# EAGLE design Main_board (EAGLE 9.6.2)

## Sheet 1 of 3
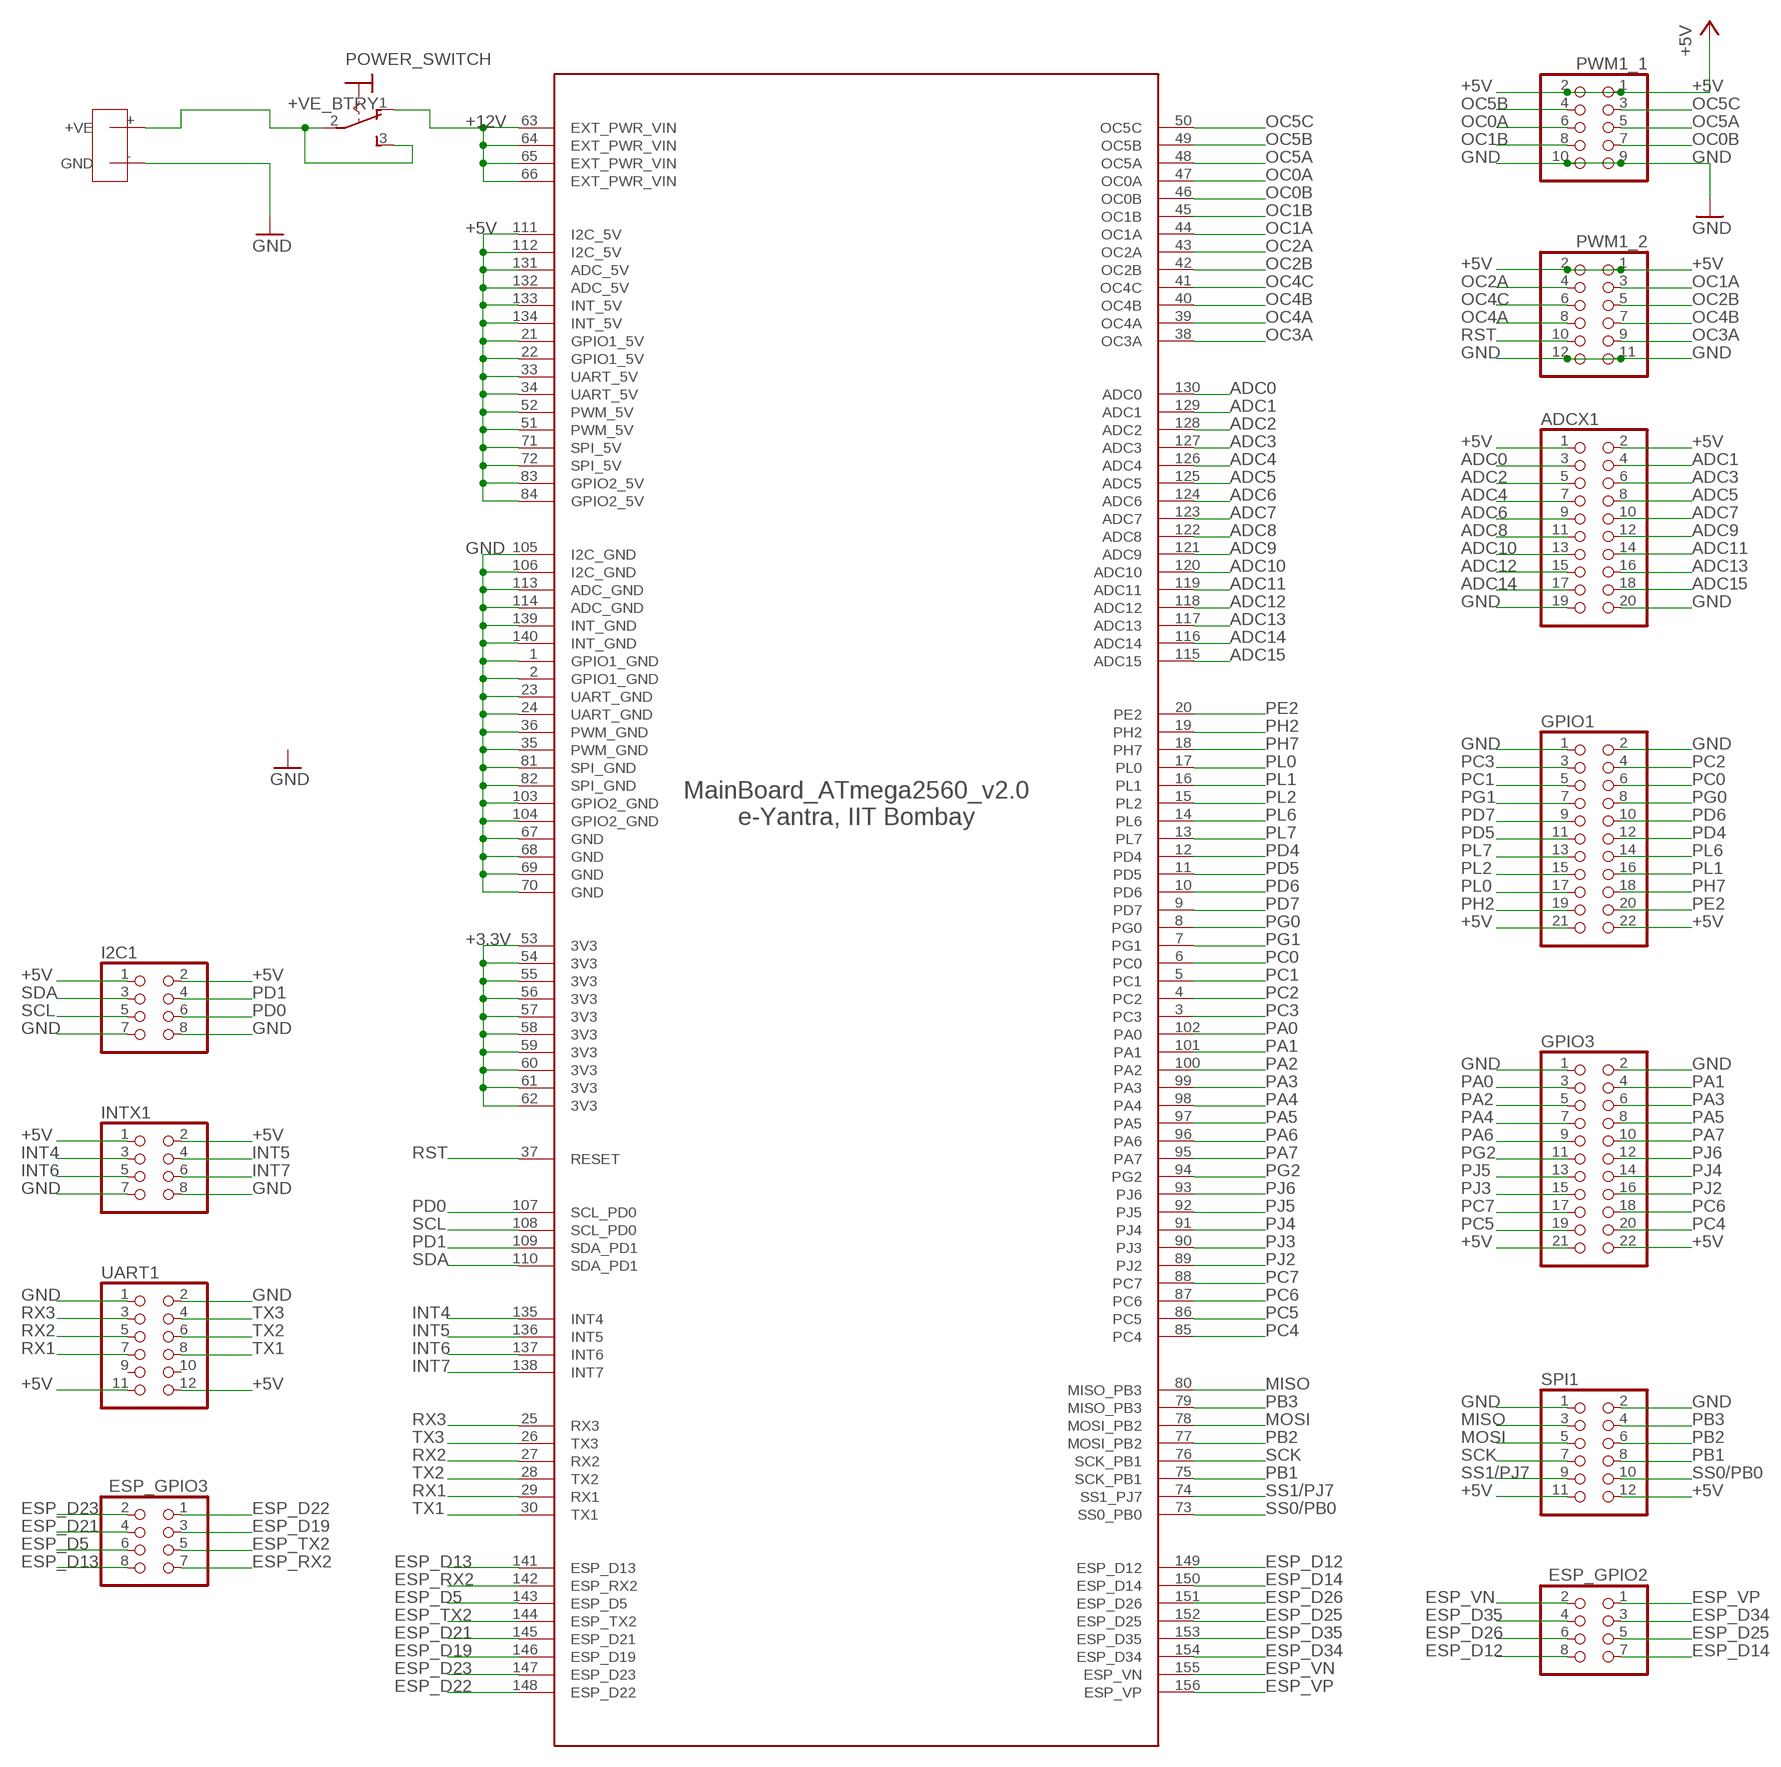
[diagram p0: schematic, sheet 1]

### Parts
ADCX1  PINHD-2X10  [2X10]
ESP_GPIO2  PINHD-2X4  [2X04]
ESP_GPIO3  PINHD-2X4  [2X04]
EYFI_MEGA  ATMEGA2560_V2.0  [ATMEGA2560_V2.0]
GPIO1  PINHD-2X11  [2X11]
GPIO3  PINHD-2X11  [2X11]
I2C1  PINHD-2X4  [2X04]
INTX1  PINHD-2X4  [2X04]
POWER_SWITCH  M9040P  [M9040P]
PWM1_1  PINHD-2X5  [2X05]
PWM1_2  PINHD-2X6  [2X06]
SPI1  PINHD-2X6  [2X06]
U$1  DEANS  [DEANS]
UART1  PINHD-2X6  [2X06]

### Nets
+3.3V: EYFI_MEGA.53(3V3) EYFI_MEGA.54(3V3) EYFI_MEGA.55(3V3) EYFI_MEGA.56(3V3) EYFI_MEGA.57(3V3) EYFI_MEGA.58(3V3) EYFI_MEGA.59(3V3) EYFI_MEGA.60(3V3) EYFI_MEGA.61(3V3) EYFI_MEGA.62(3V3) ; also sheet 2
+5V [+5V_SUPPLY]: ADCX1.1 ADCX1.2 EYFI_MEGA.21(GPIO1_5V) EYFI_MEGA.22(GPIO1_5V) EYFI_MEGA.33(UART_5V) EYFI_MEGA.34(UART_5V) EYFI_MEGA.51(PWM_5V) EYFI_MEGA.52(PWM_5V) EYFI_MEGA.71(SPI_5V) EYFI_MEGA.72(SPI_5V) EYFI_MEGA.83(GPIO2_5V) EYFI_MEGA.84(GPIO2_5V) EYFI_MEGA.111(I2C_5V) EYFI_MEGA.112(I2C_5V) EYFI_MEGA.131(ADC_5V) EYFI_MEGA.132(ADC_5V) EYFI_MEGA.133(INT_5V) EYFI_MEGA.134(INT_5V) GPIO1.21 GPIO1.22 GPIO3.21 GPIO3.22 I2C1.1 I2C1.2 INTX1.1 INTX1.2 PWM1_1.1 PWM1_1.2 PWM1_2.1 PWM1_2.2 SPI1.11 SPI1.12 UART1.11 UART1.12 ; also sheet 2
+12V [+12V_SUPPLY]: EYFI_MEGA.63(EXT_PWR_VIN) EYFI_MEGA.64(EXT_PWR_VIN) EYFI_MEGA.65(EXT_PWR_VIN) EYFI_MEGA.66(EXT_PWR_VIN) POWER_SWITCH.1(O) ; also sheet 2
+VE_BTRY [+12V_SUPPLY]: POWER_SWITCH.2(P) POWER_SWITCH.3(S) U$1.+(+VE)
ADC0: ADCX1.3 EYFI_MEGA.130(ADC0) ; also sheet 2
ADC1: ADCX1.4 EYFI_MEGA.129(ADC1) ; also sheet 2
ADC2: ADCX1.5 EYFI_MEGA.128(ADC2) ; also sheet 2
ADC3: ADCX1.6 EYFI_MEGA.127(ADC3) ; also sheet 2
ADC4: ADCX1.7 EYFI_MEGA.126(ADC4)
ADC5: ADCX1.8 EYFI_MEGA.125(ADC5)
ADC6: ADCX1.9 EYFI_MEGA.124(ADC6)
ADC7: ADCX1.10 EYFI_MEGA.123(ADC7)
ADC8: ADCX1.11 EYFI_MEGA.122(ADC8)
ADC9: ADCX1.12 EYFI_MEGA.121(ADC9)
ADC10: ADCX1.13 EYFI_MEGA.120(ADC10)
ADC11: ADCX1.14 EYFI_MEGA.119(ADC11)
ADC12: ADCX1.15 EYFI_MEGA.118(ADC12) ; also sheet 2
ADC13: ADCX1.16 EYFI_MEGA.117(ADC13) ; also sheet 2
ADC14: ADCX1.17 EYFI_MEGA.116(ADC14) ; also sheet 2
ADC15: ADCX1.18 EYFI_MEGA.115(ADC15) ; also sheet 2
ESP_D5: ESP_GPIO3.6 EYFI_MEGA.143(ESP_D5)
ESP_D12: ESP_GPIO2.8 EYFI_MEGA.149(ESP_D12)
ESP_D13: ESP_GPIO3.8 EYFI_MEGA.141(ESP_D13)
ESP_D14: ESP_GPIO2.7 EYFI_MEGA.150(ESP_D14)
ESP_D19: ESP_GPIO3.3 EYFI_MEGA.146(ESP_D19)
ESP_D21: ESP_GPIO3.4 EYFI_MEGA.145(ESP_D21)
ESP_D22: ESP_GPIO3.1 EYFI_MEGA.148(ESP_D22)
ESP_D23: ESP_GPIO3.2 EYFI_MEGA.147(ESP_D23)
ESP_D25: ESP_GPIO2.5 EYFI_MEGA.152(ESP_D25)
ESP_D26: ESP_GPIO2.6 EYFI_MEGA.151(ESP_D26)
ESP_D34: ESP_GPIO2.3 EYFI_MEGA.154(ESP_D34)
ESP_D35: ESP_GPIO2.4 EYFI_MEGA.153(ESP_D35)
ESP_RX2: ESP_GPIO3.7 EYFI_MEGA.142(ESP_RX2)
ESP_TX2: ESP_GPIO3.5 EYFI_MEGA.144(ESP_TX2)
ESP_VN [+5V_SUPPLY]: ESP_GPIO2.2 EYFI_MEGA.155(ESP_VN)
ESP_VP [+5V_SUPPLY]: ESP_GPIO2.1 EYFI_MEGA.156(ESP_VP)
GND: ADCX1.19 ADCX1.20 EYFI_MEGA.1(GPIO1_GND) EYFI_MEGA.2(GPIO1_GND) EYFI_MEGA.23(UART_GND) EYFI_MEGA.24(UART_GND) EYFI_MEGA.35(PWM_GND) EYFI_MEGA.36(PWM_GND) EYFI_MEGA.67(GND) EYFI_MEGA.68(GND) EYFI_MEGA.69(GND) EYFI_MEGA.70(GND) EYFI_MEGA.81(SPI_GND) EYFI_MEGA.82(SPI_GND) EYFI_MEGA.103(GPIO2_GND) EYFI_MEGA.104(GPIO2_GND) EYFI_MEGA.105(I2C_GND) EYFI_MEGA.106(I2C_GND) EYFI_MEGA.113(ADC_GND) EYFI_MEGA.114(ADC_GND) EYFI_MEGA.139(INT_GND) EYFI_MEGA.140(INT_GND) GPIO1.1 GPIO1.2 GPIO3.1 GPIO3.2 I2C1.7 I2C1.8 INTX1.7 INTX1.8 PWM1_1.9 PWM1_1.10 PWM1_2.11 PWM1_2.12 SPI1.1 SPI1.2 U$1.-(GND) UART1.1 UART1.2 ; also sheet 2
INT4: EYFI_MEGA.135(INT4) INTX1.3 ; also sheet 2
INT5: EYFI_MEGA.136(INT5) INTX1.4 ; also sheet 2
INT6: EYFI_MEGA.137(INT6) INTX1.5 ; also sheet 2
INT7: EYFI_MEGA.138(INT7) INTX1.6 ; also sheet 2
MISO: EYFI_MEGA.80(MISO_PB3) SPI1.3
MOSI: EYFI_MEGA.78(MOSI_PB2) SPI1.5
OC0A: EYFI_MEGA.47(OC0A) PWM1_1.6
OC0B: EYFI_MEGA.46(OC0B) PWM1_1.7
OC1A: EYFI_MEGA.44(OC1A) PWM1_2.3
OC1B: EYFI_MEGA.45(OC1B) PWM1_1.8 ; also sheet 2
OC2A: EYFI_MEGA.43(OC2A) PWM1_2.4
OC2B: EYFI_MEGA.42(OC2B) PWM1_2.5 ; also sheet 2
OC3A: EYFI_MEGA.38(OC3A) PWM1_2.9 ; also sheet 2
OC4A: EYFI_MEGA.39(OC4A) PWM1_2.8 ; also sheet 2
OC4B: EYFI_MEGA.40(OC4B) PWM1_2.7 ; also sheet 2
OC4C: EYFI_MEGA.41(OC4C) PWM1_2.6 ; also sheet 2
OC5A: EYFI_MEGA.48(OC5A) PWM1_1.5 ; also sheet 2
OC5B: EYFI_MEGA.49(OC5B) PWM1_1.4 ; also sheet 2
OC5C: EYFI_MEGA.50(OC5C) PWM1_1.3
PA0: EYFI_MEGA.102(PA0) GPIO3.3 ; also sheet 2
PA1: EYFI_MEGA.101(PA1) GPIO3.4 ; also sheet 2
PA2: EYFI_MEGA.100(PA2) GPIO3.5 ; also sheet 2
PA3: EYFI_MEGA.99(PA3) GPIO3.6 ; also sheet 2
PA4: EYFI_MEGA.98(PA4) GPIO3.7 ; also sheet 2
PA5: EYFI_MEGA.97(PA5) GPIO3.8 ; also sheet 2
PA6: EYFI_MEGA.96(PA6) GPIO3.9 ; also sheet 2
PA7: EYFI_MEGA.95(PA7) GPIO3.10 ; also sheet 2
PB1: EYFI_MEGA.75(SCK_PB1) SPI1.8
PB2: EYFI_MEGA.77(MOSI_PB2) SPI1.6
PB3: EYFI_MEGA.79(MISO_PB3) SPI1.4
PC0: EYFI_MEGA.6(PC0) GPIO1.6 ; also sheet 2
PC1: EYFI_MEGA.5(PC1) GPIO1.5 ; also sheet 2
PC2: EYFI_MEGA.4(PC2) GPIO1.4 ; also sheet 2
PC3: EYFI_MEGA.3(PC3) GPIO1.3 ; also sheet 2
PC4: EYFI_MEGA.85(PC4) GPIO3.20 ; also sheet 2
PC5: EYFI_MEGA.86(PC5) GPIO3.19 ; also sheet 2
PC6: EYFI_MEGA.87(PC6) GPIO3.18 ; also sheet 2
PC7: EYFI_MEGA.88(PC7) GPIO3.17 ; also sheet 2
PD0: EYFI_MEGA.107(SCL_PD0) I2C1.6
PD1: EYFI_MEGA.109(SDA_PD1) I2C1.4
PD4: EYFI_MEGA.12(PD4) GPIO1.12 ; also sheet 2
PD5: EYFI_MEGA.11(PD5) GPIO1.11 ; also sheet 2
PD6: EYFI_MEGA.10(PD6) GPIO1.10 ; also sheet 2
PD7: EYFI_MEGA.9(PD7) GPIO1.9 ; also sheet 2
PE2: EYFI_MEGA.20(PE2) GPIO1.20
PG0: EYFI_MEGA.8(PG0) GPIO1.8
PG1: EYFI_MEGA.7(PG1) GPIO1.7
PG2: EYFI_MEGA.94(PG2) GPIO3.11 ; also sheet 2
PH2: EYFI_MEGA.19(PH2) GPIO1.19
PH7: EYFI_MEGA.18(PH7) GPIO1.18
PJ2: EYFI_MEGA.89(PJ2) GPIO3.16
PJ3: EYFI_MEGA.90(PJ3) GPIO3.15
PJ4: EYFI_MEGA.91(PJ4) GPIO3.14
PJ5: EYFI_MEGA.92(PJ5) GPIO3.13
PJ6: EYFI_MEGA.93(PJ6) GPIO3.12 ; also sheet 2
PL0: EYFI_MEGA.17(PL0) GPIO1.17
PL1: EYFI_MEGA.16(PL1) GPIO1.16
PL2: EYFI_MEGA.15(PL2) GPIO1.15
PL6: EYFI_MEGA.14(PL6) GPIO1.14
PL7: EYFI_MEGA.13(PL7) GPIO1.13
RST: EYFI_MEGA.37(RESET) PWM1_2.10
RX1: EYFI_MEGA.29(RX1) UART1.7 ; also sheet 2
RX2: EYFI_MEGA.27(RX2) UART1.5
RX3: EYFI_MEGA.25(RX3) UART1.3
SCK: EYFI_MEGA.76(SCK_PB1) SPI1.7
SCL: EYFI_MEGA.108(SCL_PD0) I2C1.5 ; also sheet 2
SDA: EYFI_MEGA.110(SDA_PD1) I2C1.3 ; also sheet 2
SS0/PB0: EYFI_MEGA.73(SS0_PB0) SPI1.10
SS1/PJ7: EYFI_MEGA.74(SS1_PJ7) SPI1.9
TX1: EYFI_MEGA.30(TX1) UART1.8
TX2: EYFI_MEGA.28(TX2) UART1.6
TX3: EYFI_MEGA.26(TX3) UART1.4
Unconnected: UART1.9 UART1.10

## Sheet 2 of 3
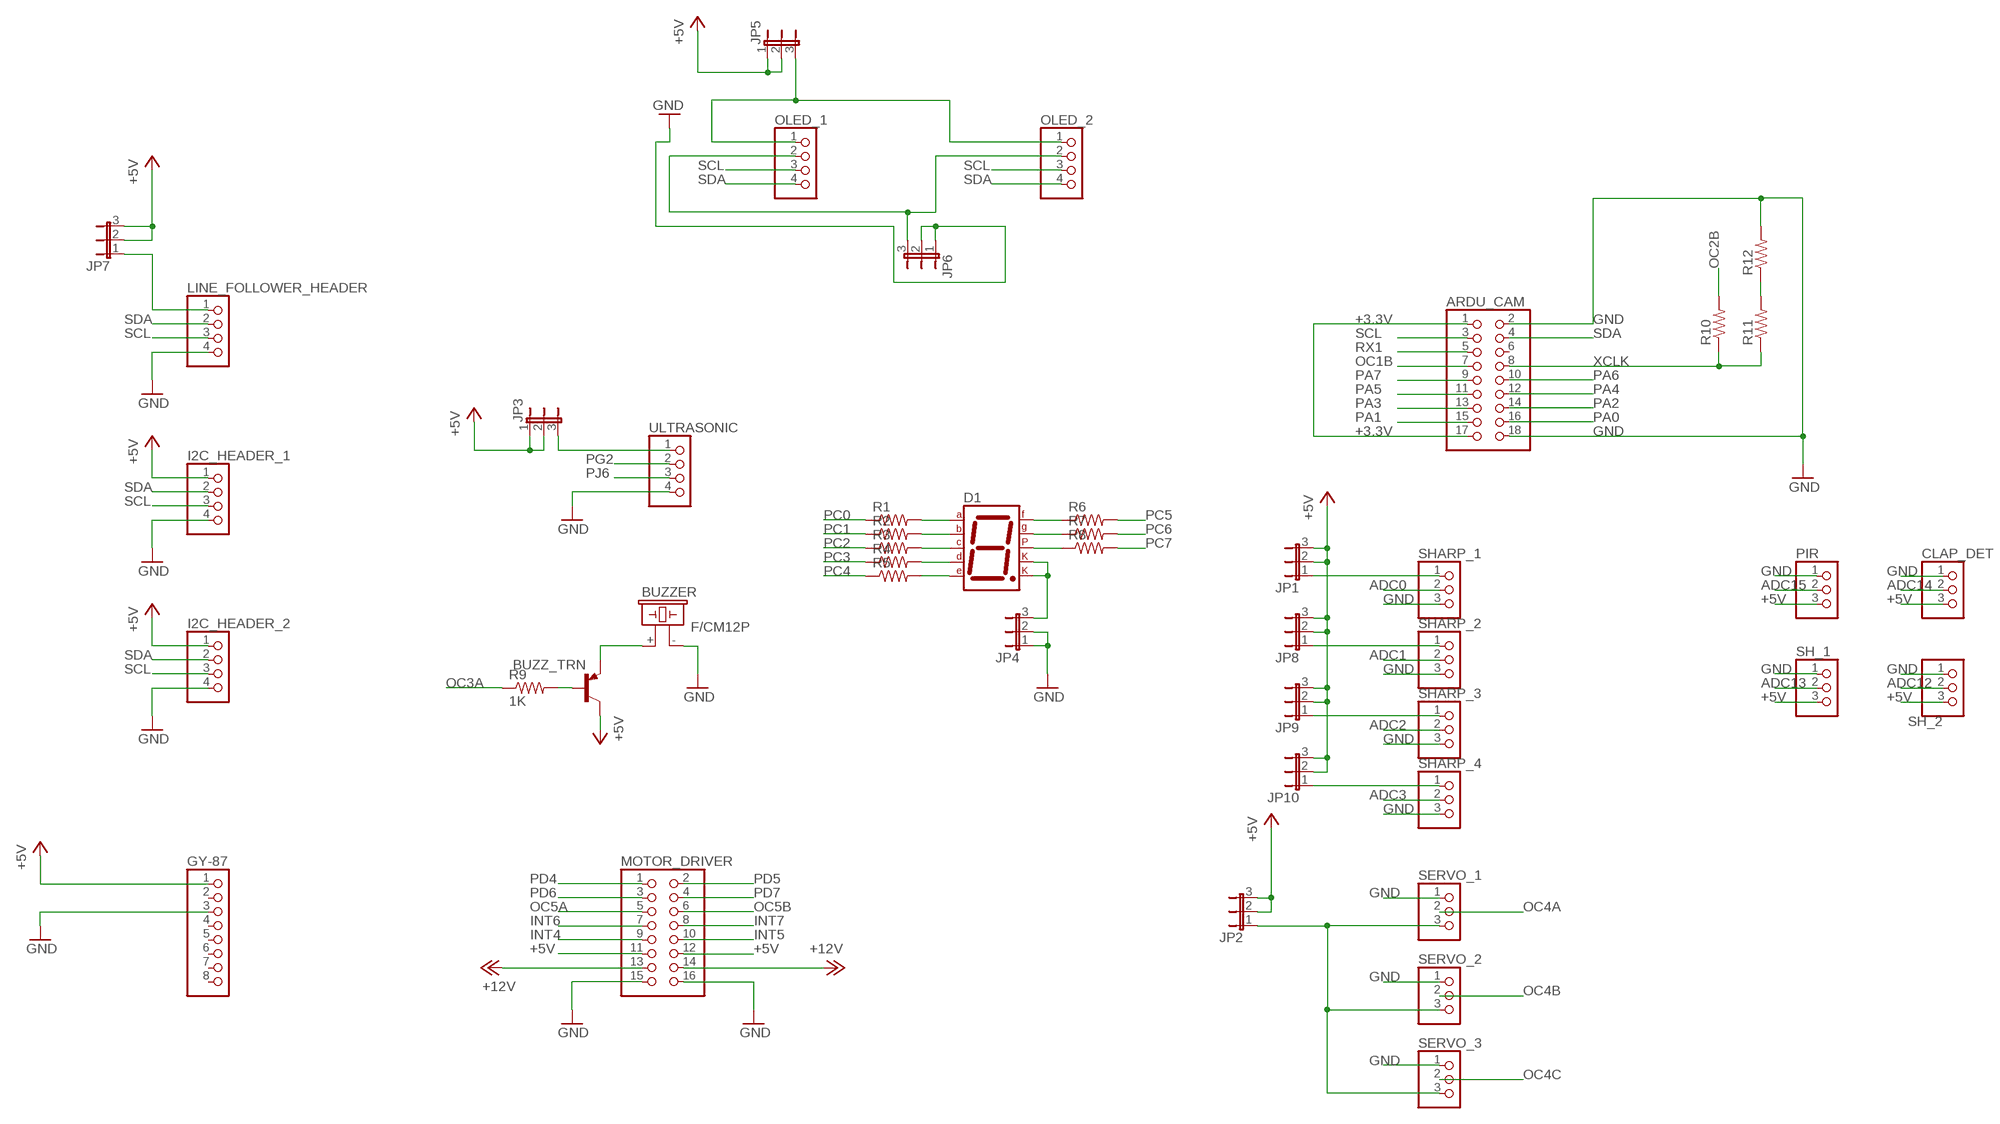
[diagram p1: schematic, sheet 2]

### Parts
ARDU_CAM  PINHD-2X9  [2X09]
BUZZ_TRN  BC807-16-PNP-SOT23-BEC  [SOT23-BEC]
BUZZER  F/CM12P  [F/CM12P]
CLAP_DET  PINHD-1X3  [1X03]
D1  7SEG-CK  [7SEG-13]
GY-87  PINHD-1X8  [1X08]
I2C_HEADER_1  PINHD-1X4  [1X04]
I2C_HEADER_2  PINHD-1X4  [1X04]
JP1  JP2E  [JP2]
JP2  JP2E  [JP2]
JP3  JP2E  [JP2]
JP4  JP2E  [JP2]
JP5  JP2E  [JP2]
JP6  JP2E  [JP2]
JP7  JP2E  [JP2]
JP8  JP2E  [JP2]
JP9  JP2E  [JP2]
JP10  JP2E  [JP2]
LINE_FOLLOWER_HEADER  PINHD-1X4  [1X04]
MOTOR_DRIVER  PINHD-2X8  [2X08]
OLED_1  PINHD-1X4  [1X04]
OLED_2  PINHD-1X4  [1X04]
PIR  PINHD-1X3  [1X03]
R1  R-US_R1206  [R1206]
R2  R-US_R1206  [R1206]
R3  R-US_R1206  [R1206]
R4  R-US_R1206  [R1206]
R5  R-US_R1206  [R1206]
R6  R-US_R1206  [R1206]
R7  R-US_R1206  [R1206]
R8  R-US_R1206  [R1206]
R9  1K  R-US_R1206  [R1206]
R10  R-US_R1206  [R1206]
R11  R-US_R1206  [R1206]
R12  R-US_R1206  [R1206]
SERVO_1  PINHD-1X3  [1X03]
SERVO_2  PINHD-1X3  [1X03]
SERVO_3  PINHD-1X3  [1X03]
SH_1  PINHD-1X3  [1X03]
SH_2  PINHD-1X3  [1X03]
SHARP_1  PINHD-1X3  [1X03]
SHARP_2  PINHD-1X3  [1X03]
SHARP_3  PINHD-1X3  [1X03]
SHARP_4  PINHD-1X3  [1X03]
ULTRASONIC  PINHD-1X4  [1X04]

### Nets
+3.3V: ARDU_CAM.1 ARDU_CAM.17 ; also sheet 1
+5V [+5V_SUPPLY]: BUZZ_TRN.C CLAP_DET.3 GY-87.1 I2C_HEADER_1.1 I2C_HEADER_2.1 JP1.2 JP1.3 JP2.2 JP2.3 JP3.1 JP3.2 JP5.1 JP5.2 JP7.2 JP7.3 JP8.2 JP8.3 JP9.2 JP9.3 JP10.2 JP10.3 MOTOR_DRIVER.11 MOTOR_DRIVER.12 PIR.3 SH_1.3 SH_2.3 ; also sheet 1
+12V [+12V_SUPPLY]: MOTOR_DRIVER.13 MOTOR_DRIVER.14 ; also sheet 1
ADC0: SHARP_1.2 ; also sheet 1
ADC1: SHARP_2.2 ; also sheet 1
ADC2: SHARP_3.2 ; also sheet 1
ADC3: SHARP_4.2 ; also sheet 1
ADC12: SH_2.2 ; also sheet 1
ADC13: SH_1.2 ; also sheet 1
ADC14: CLAP_DET.2 ; also sheet 1
ADC15: PIR.2 ; also sheet 1
GND: ARDU_CAM.2 ARDU_CAM.18 BUZZER.- CLAP_DET.1 GY-87.3 I2C_HEADER_1.4 I2C_HEADER_2.4 JP4.1 JP4.2 JP6.1 JP6.2 LINE_FOLLOWER_HEADER.4 MOTOR_DRIVER.15 MOTOR_DRIVER.16 PIR.1 R12.2 SERVO_1.1 SERVO_2.1 SERVO_3.1 SH_1.1 SH_2.1 SHARP_1.3 SHARP_2.3 SHARP_3.3 SHARP_4.3 ULTRASONIC.4 ; also sheet 1
INT4: MOTOR_DRIVER.9 ; also sheet 1
INT5: MOTOR_DRIVER.10 ; also sheet 1
INT6: MOTOR_DRIVER.7 ; also sheet 1
INT7: MOTOR_DRIVER.8 ; also sheet 1
N$1 [+5V_SUPPLY]: JP1.1 SHARP_1.1
N$2: D1.7(A) R1.2
N$3: BUZZ_TRN.E BUZZER.+
N$4: D1.6(B) R2.2
N$5: BUZZ_TRN.B R9.2
N$6: D1.4(C) R3.2
N$7: D1.2(D) R4.2
N$8: D1.1(E) R5.2
N$9: D1.9(F) R6.1
N$10: D1.10(G) R7.1
N$11: D1.5(DP) R8.1
N$12 [+5V_SUPPLY]: JP3.3 ULTRASONIC.1
N$13: D1.3(CK1) D1.8(CK2) JP4.3
N$14 [+5V_SUPPLY]: JP5.3 OLED_1.1 OLED_2.1
N$15: JP6.3 OLED_1.2 OLED_2.2
N$16: JP7.1 LINE_FOLLOWER_HEADER.1
N$17: R11.2 R12.1
N$18 [+5V_SUPPLY]: JP8.1 SHARP_2.1
N$19 [+5V_SUPPLY]: JP10.1 SHARP_4.1
N$22 [+5V_SUPPLY]: JP9.1 SHARP_3.1
N$23 [+5V_SUPPLY]: JP2.1 SERVO_1.3 SERVO_2.3 SERVO_3.3
OC1B: ARDU_CAM.7 ; also sheet 1
OC2B: R10.2 ; also sheet 1
OC3A: R9.1 ; also sheet 1
OC4A: SERVO_1.2 ; also sheet 1
OC4B: SERVO_2.2 ; also sheet 1
OC4C: SERVO_3.2 ; also sheet 1
OC5A: MOTOR_DRIVER.5 ; also sheet 1
OC5B: MOTOR_DRIVER.6 ; also sheet 1
PA0: ARDU_CAM.16 ; also sheet 1
PA1: ARDU_CAM.15 ; also sheet 1
PA2: ARDU_CAM.14 ; also sheet 1
PA3: ARDU_CAM.13 ; also sheet 1
PA4: ARDU_CAM.12 ; also sheet 1
PA5: ARDU_CAM.11 ; also sheet 1
PA6: ARDU_CAM.10 ; also sheet 1
PA7: ARDU_CAM.9 ; also sheet 1
PC0: R1.1 ; also sheet 1
PC1: R2.1 ; also sheet 1
PC2: R3.1 ; also sheet 1
PC3: R4.1 ; also sheet 1
PC4: R5.1 ; also sheet 1
PC5: R6.2 ; also sheet 1
PC6: R7.2 ; also sheet 1
PC7: R8.2 ; also sheet 1
PD4: MOTOR_DRIVER.1 ; also sheet 1
PD5: MOTOR_DRIVER.2 ; also sheet 1
PD6: MOTOR_DRIVER.3 ; also sheet 1
PD7: MOTOR_DRIVER.4 ; also sheet 1
PG2: ULTRASONIC.2 ; also sheet 1
PJ6: ULTRASONIC.3 ; also sheet 1
RX1: ARDU_CAM.5 ; also sheet 1
SCL: ARDU_CAM.3 I2C_HEADER_1.3 I2C_HEADER_2.3 LINE_FOLLOWER_HEADER.3 OLED_1.3 OLED_2.3 ; also sheet 1
SDA: ARDU_CAM.4 I2C_HEADER_1.2 I2C_HEADER_2.2 LINE_FOLLOWER_HEADER.2 OLED_1.4 OLED_2.4 ; also sheet 1
XCLK: ARDU_CAM.8 R10.1 R11.1
Unconnected: ARDU_CAM.6 GY-87.2 GY-87.4 GY-87.5 GY-87.6 GY-87.7 GY-87.8

## Sheet 3 of 3

## Library data of the parts
ADCX1 = pinhead:PINHD-2X10: PIN HEADER
ARDU_CAM = pinhead:PINHD-2X9: PIN HEADER
BUZZ_TRN = transistor:*-PNP-: PNP Transistror
BUZZER = buzzer:F/CM12P: BUZZER Source: Buerklin; OC_FARNELL: unknown; OC_NEWARK: unknown
CLAP_DET PIR SERVO_1-SERVO_3 SH_1 SH_2 SHARP_1-SHARP_4 = pinhead:PINHD-1X3: PIN HEADER
D1 = special:7SEG-CK: 7-segment DISPLAY single cathode, 13 mm
ESP_GPIO2 ESP_GPIO3 I2C1 INTX1 = pinhead:PINHD-2X4: PIN HEADER
EYFI_MEGA = eYFi-Mega_v2.0.1:ATMEGA2560_V2.0
GPIO1 GPIO3 = pinhead:PINHD-2X11: PIN HEADER
GY-87 = pinhead:PINHD-1X8: PIN HEADER
I2C_HEADER_1 I2C_HEADER_2 LINE_FOLLOWER_HEADER OLED_1 OLED_2 ULTRASONIC = pinhead:PINHD-1X4: PIN HEADER
JP1-JP10 = jumper:JP2E: JUMPER
MOTOR_DRIVER = pinhead:PINHD-2X8: PIN HEADER
POWER_SWITCH = switch:M9040P: TOGGLE SWITCH Marquardt
PWM1_1 = pinhead:PINHD-2X5: PIN HEADER
PWM1_2 SPI1 UART1 = pinhead:PINHD-2X6: PIN HEADER
R1-R12 = rcl:R-US_: RESISTOR, American symbol; SPICEPREFIX: R
U$1 = DEANS:DEANS

## Net classes
0 default: width 0.305 mm
1 +5V_SUPPLY: width 0.813 mm
2 +12V_SUPPLY: width 1.27 mm

## Board
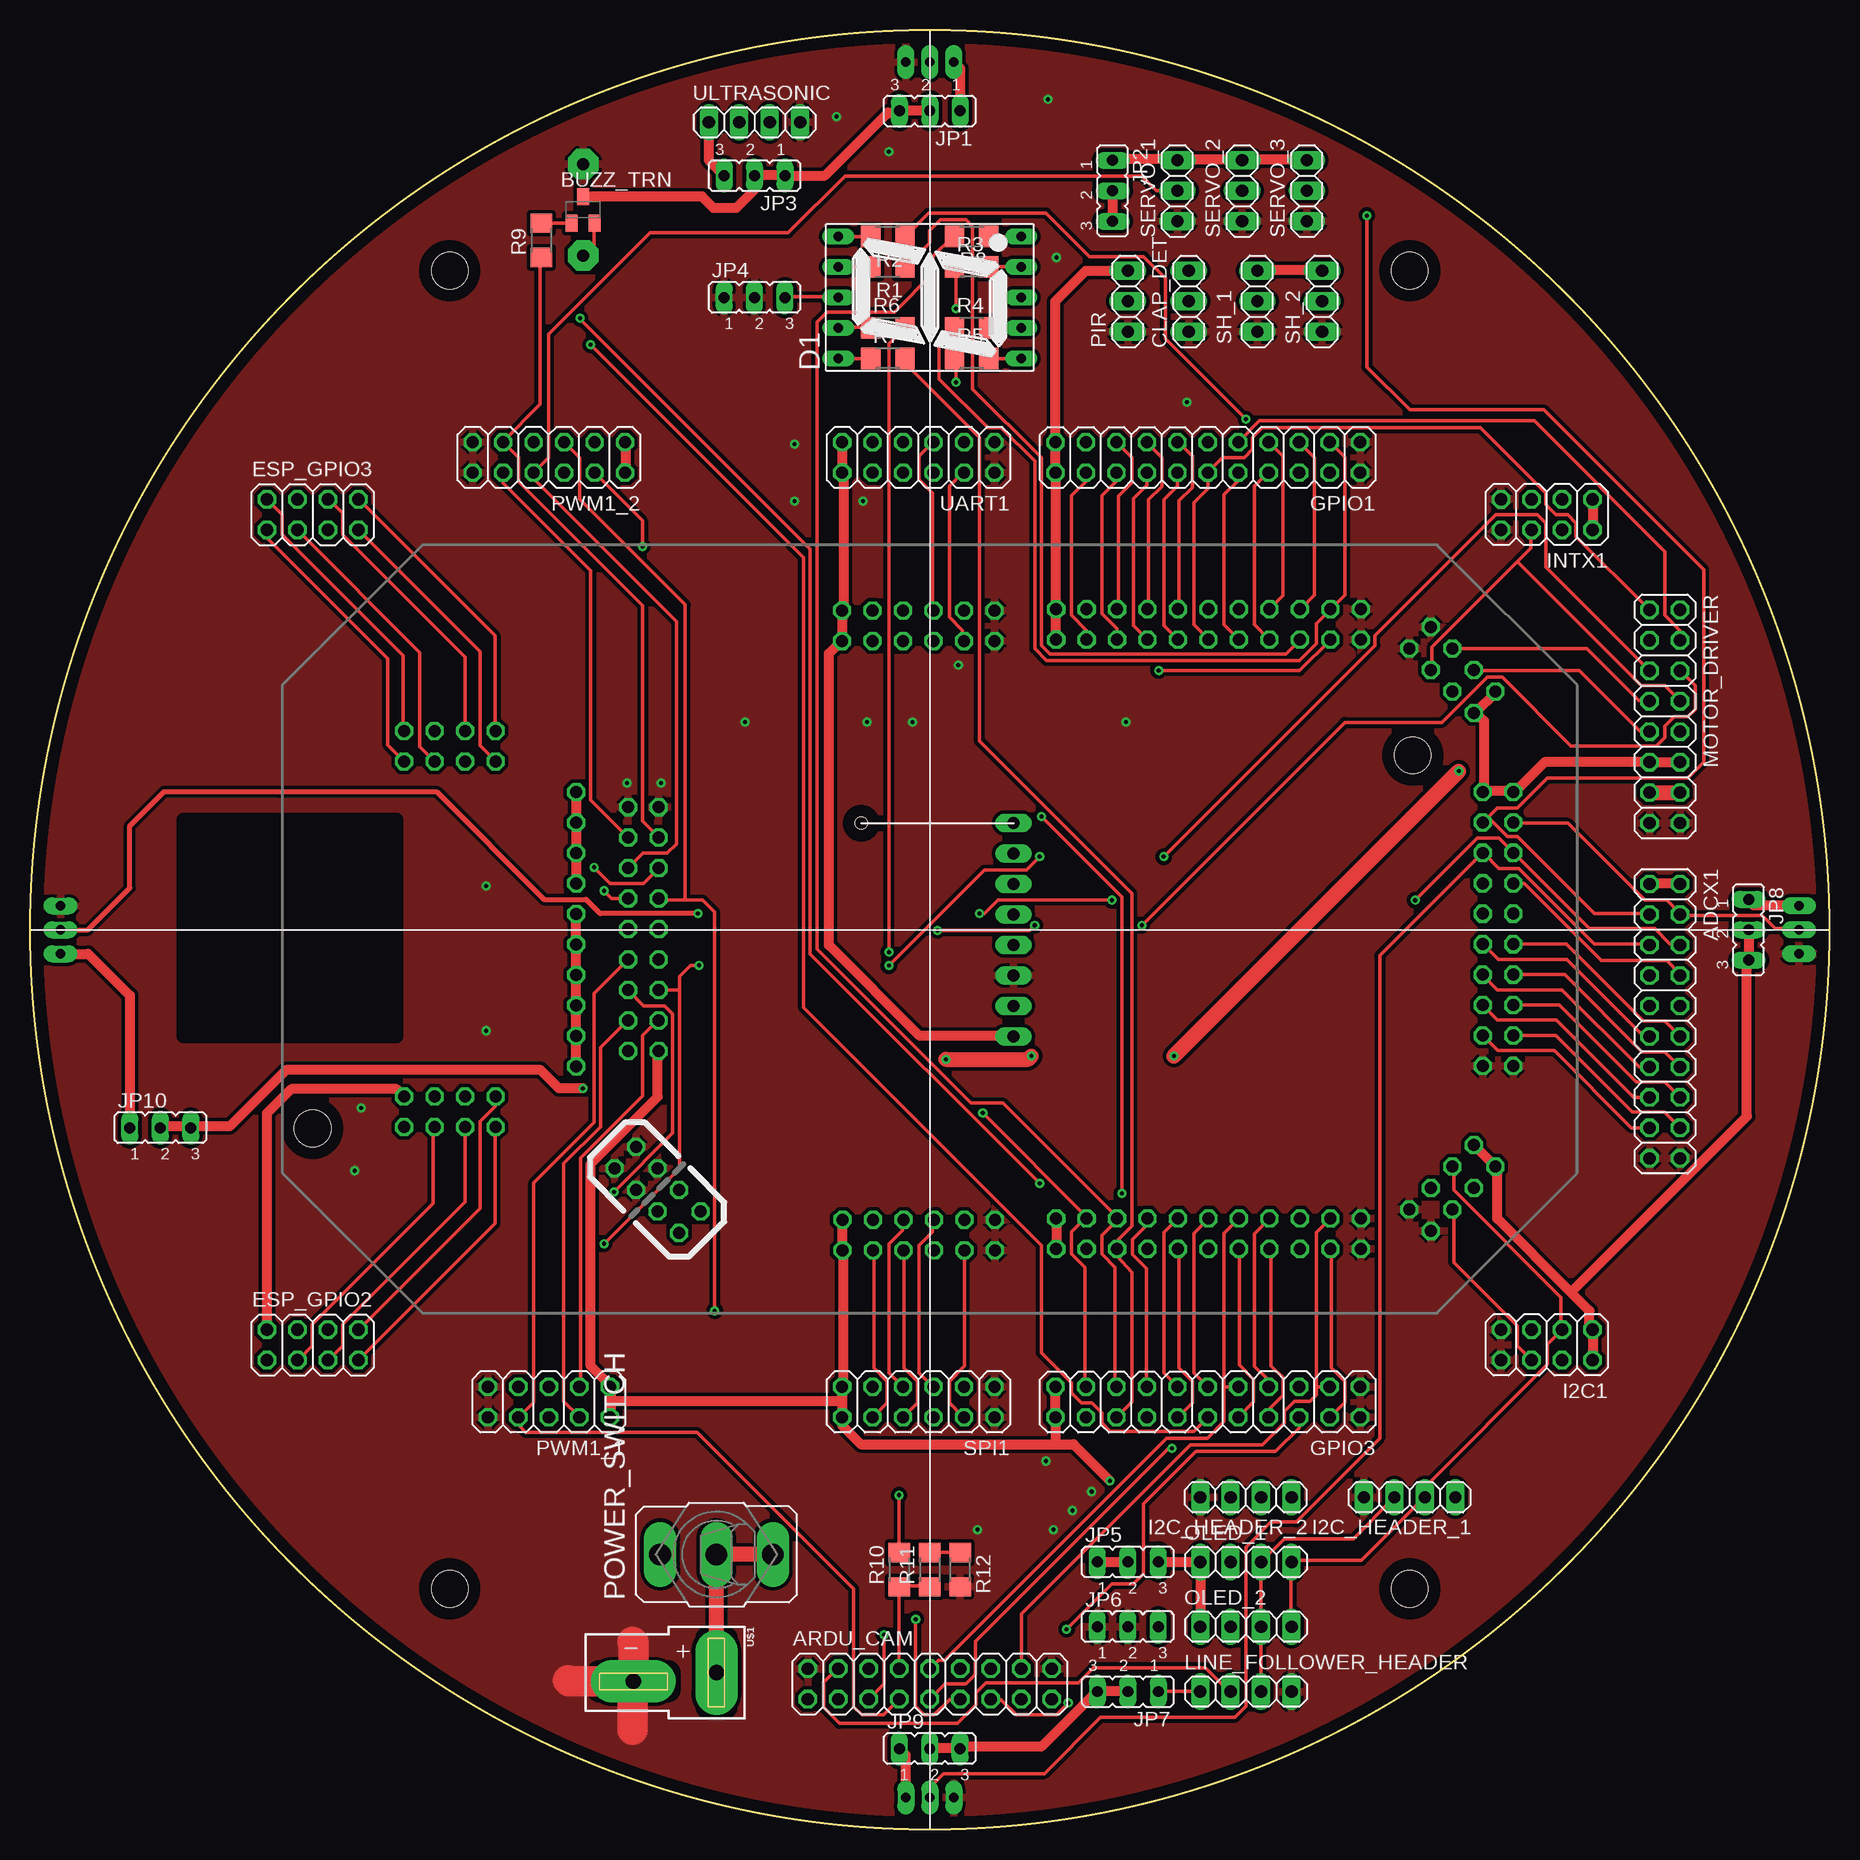
[diagram p2: board, top side]
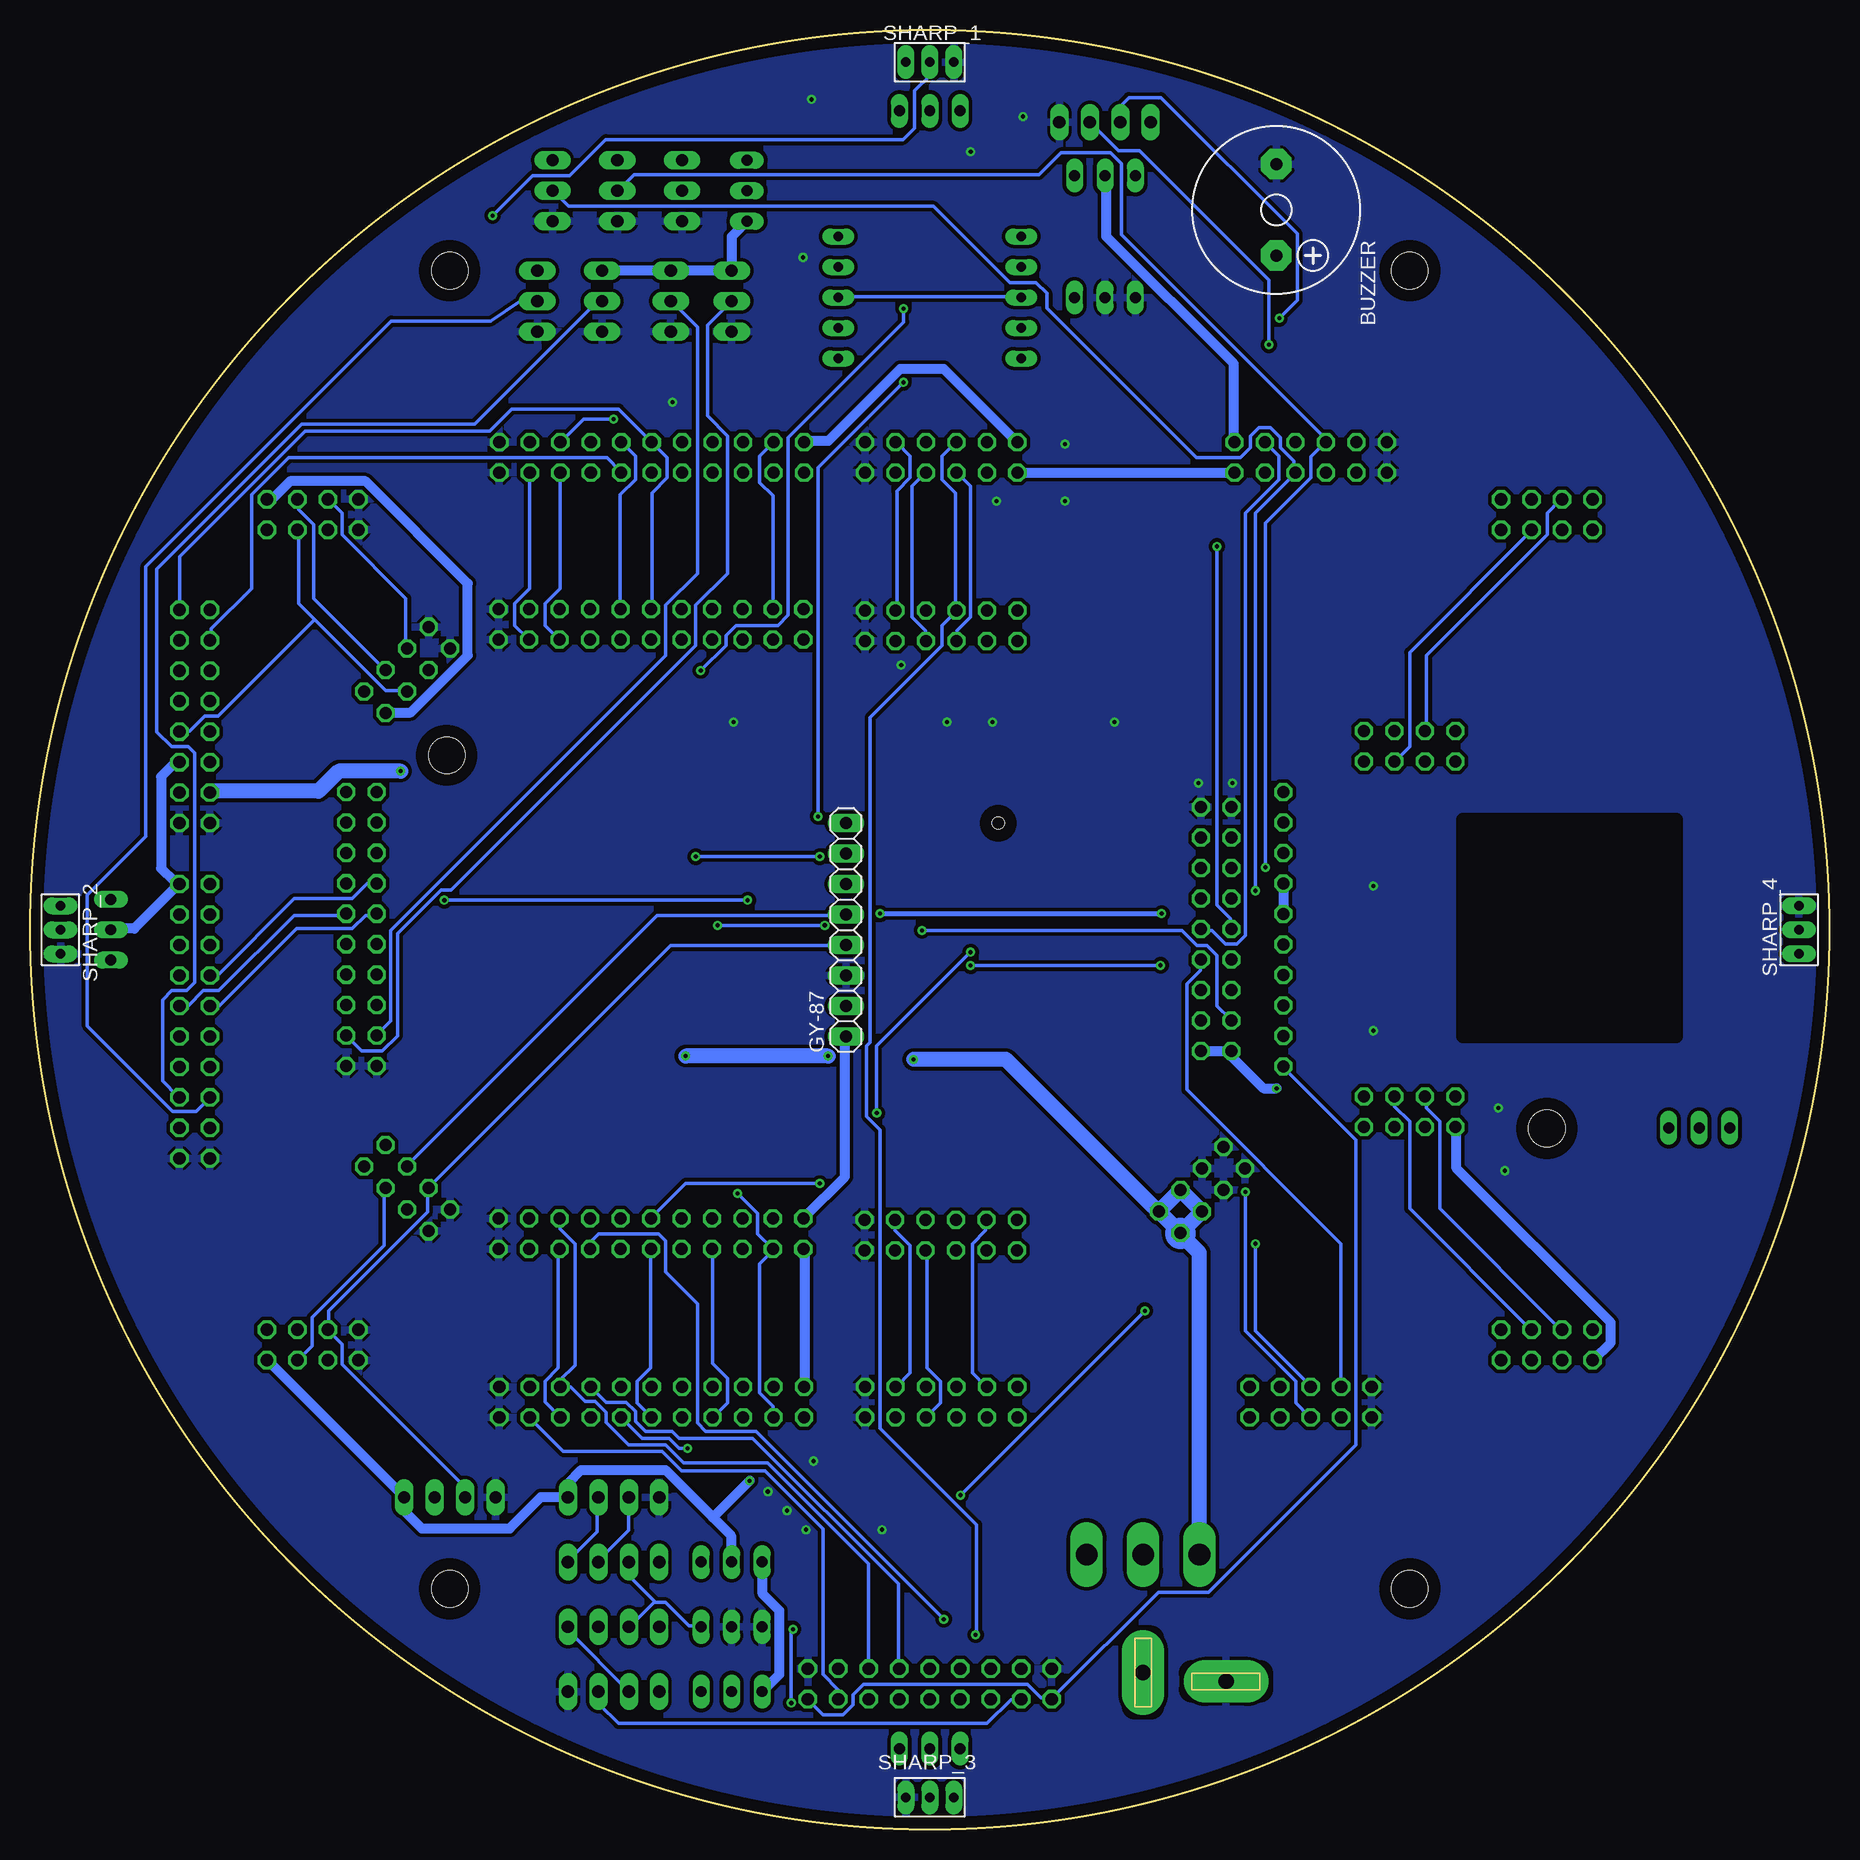
[diagram p3: board, bottom side, seen from below]

Size 150 x 150 mm. Coordinates in mm from the lower left corner, seen from the top.
Outline: circle at 75,75 radius 75
Copper layers (1*16): Top 0.035mm / dielectric 0.15mm / Bottom 0.035mm
Design rules "default *": minimum track width 12mil, minimum drill 0.35mm, track to track 10mil, track to pad 10mil, pad to pad 10mil, via to via 8mil, smd to smd 8mil, copper to edge 40mil, drill to drill 8mil, minimum pad ring 10mil, minimum via ring 8mil, stop-mask expansion 4mil, vias tented up to drill 0mil, thermal gap 10mil
Holes 1 mm at 69.28,83.89
Holes 3.05 mm at 115,129.93 115,20.07 34.99,20.07 34.99,129.93
tRestrict: 4 lines
bRestrict: 4 lines

### Footprints (pad centres in the part's own frame; a part is rotated, then mirrored left to right if it is on the bottom)
2X10 = drill 1.016 octagon: 1 -11.43,-1.27; 2 -11.43,1.27; 3 -8.89,-1.27; 4 -8.89,1.27; 5 -6.35,-1.27; 6 -6.35,1.27; 7 -3.81,-1.27; 8 -3.81,1.27; 9 -1.27,-1.27; 10 -1.27,1.27; 11 1.27,-1.27; 12 1.27,1.27; 13 3.81,-1.27; 14 3.81,1.27; 15 6.35,-1.27; 16 6.35,1.27; 17 8.89,-1.27; 18 8.89,1.27; 19 11.43,-1.27; 20 11.43,1.27
2X09 = drill 1.016 octagon: 1 -10.16,-1.27; 2 -10.16,1.27; 3 -7.62,-1.27; 4 -7.62,1.27; 5 -5.08,-1.27; 6 -5.08,1.27; 7 -2.54,-1.27; 8 -2.54,1.27; 9 0,-1.27; 10 0,1.27; 11 2.54,-1.27; 12 2.54,1.27; 13 5.08,-1.27; 14 5.08,1.27; 15 7.62,-1.27; 16 7.62,1.27; 17 10.16,-1.27; 18 10.16,1.27
SOT23-BEC = smd 1 x 1.4: B -0.95,-1.1; C 0,1.1; E 0.95,-1.1
F/CM12P = drill 1.016 pad 2.54 octagon: + 3.81,0; - -3.81,0
1X03 = drill 1.016 long: 1 -2.54,0; 2 0,0; 3 2.54,0
7SEG-13 = drill 0.813 long: 1 -5.08,-7.62; 2 -2.54,-7.62; 3 0,-7.62; 4 2.54,-7.62; 5 5.08,-7.62; 6 5.08,7.62; 7 2.54,7.62; 8 0,7.62; 9 -2.54,7.62; 10 -5.08,7.62
2X04 = drill 1.016 octagon: 1 -3.81,-1.27; 2 -3.81,1.27; 3 -1.27,-1.27; 4 -1.27,1.27; 5 1.27,-1.27; 6 1.27,1.27; 7 3.81,-1.27; 8 3.81,1.27
ATMEGA2560_V2.0 = drill 1 octagon: 1 5.344,89.916; 2 7.884,89.916; 3 5.344,87.376; 4 7.884,87.376; 5 5.344,84.836; 6 7.884,84.836; 7 5.344,82.296; 8 7.884,82.296; 9 5.344,79.756; 10 7.884,79.756; 11 5.344,77.216; 12 7.884,77.216; 13 5.344,74.676; 14 7.884,74.676; 15 5.344,72.136; 16 7.884,72.136; 17 5.344,69.596; 18 7.884,69.596; 19 5.344,67.056; 20 7.884,67.056; 21 5.344,64.516; 22 7.884,64.516; 23 5.461,59.373; 24 8.001,59.373; 25 5.461,56.833; 26 8.001,56.833; 27 5.461,54.292; 28 8.001,54.292; 29 5.461,51.752; 30 8.001,51.752; 31 5.461,49.212; 32 8.001,49.212; 33 5.461,46.672; 34 8.001,46.672; 35 21.857,28.839; 36 21.857,31.379; 37 24.397,28.839; 38 24.397,31.379; 39 26.937,28.839; 40 26.937,31.379; 41 29.477,28.839; 42 29.477,31.379; 43 32.017,28.839; 44 32.017,31.379; 45 34.557,28.839; 46 34.557,31.379; 47 37.097,28.839; 48 37.097,31.379; 49 39.637,28.839; 50 39.637,31.379; 51 42.177,28.839; 52 42.177,31.379; 53 20.592,24.511; 54 23.132,24.511; 55 25.672,24.511; 56 28.212,24.511; 57 30.752,24.511; 58 33.292,24.511; 59 35.832,24.511; 60 38.372,24.511; 61 40.912,24.511; 62 43.452,24.511; 63 57.348,33.078; 64 55.552,34.874; 65 55.552,31.282; 66 53.756,33.078; 67 53.756,29.486; 68 51.96,31.282; 69 51.96,27.69; 70 50.164,29.486; 71 58.783,46.711; 72 56.243,46.711; 73 58.783,49.251; 74 56.243,49.251; 75 58.783,51.791; 76 56.243,51.791; 77 58.783,54.331; 78 56.243,54.331; 79 58.783,56.871; 80 56.243,56.871; 81 58.783,59.411; 82 56.243,59.411; 83 58.674,64.516; 84 56.134,64.516; 85 58.674,67.056; 86 56.134,67.056; 87 58.674,69.596; 88 56.134,69.596; 89 58.674,72.136; 90 56.134,72.136; 91 58.674,74.676; 92 56.134,74.676; 93 58.674,77.216; 94 56.134,77.216; 95 58.674,79.756; 96 56.134,79.756; 97 58.674,82.296; 98 56.134,82.296; 99 58.674,84.836; 100 56.134,84.836; 101 58.674,87.376; 102 56.134,87.376; 103 58.674,89.916; 104 56.134,89.916; 105 57.192,95.746; 106 55.396,93.95; 107 55.396,97.542; 108 53.6,95.746; 109 53.6,99.338; 110 51.804,97.542; 111 51.804,101.135; 112 50.008,99.338; 113 43.434,102.616; 114 43.434,100.076; 115 40.894,102.616; 116 40.894,100.076; 117 38.354,102.616; 118 38.354,100.076; 119 35.814,102.616; 120 35.814,100.076; 121 33.274,102.616; 122 33.274,100.076; 123 30.734,102.616; 124 30.734,100.076; 125 28.194,102.616; 126 28.194,100.076; 127 25.654,102.616; 128 25.654,100.076; 129 23.114,102.616; 130 23.114,100.076; 131 20.574,102.616; 132 20.574,100.076; 133 12.208,101.133; 134 14.004,99.337; 135 10.411,99.337; 136 12.208,97.541; 137 8.615,97.541; 138 10.411,95.745; 139 6.819,95.745; 140 8.615,93.949; 141 15.494,17.78; 142 18.034,17.78; 143 15.494,15.24; 144 18.034,15.24; 145 15.494,12.7; 146 18.034,12.7; 147 15.494,10.16; 148 18.034,10.16; 149 45.974,17.78; 150 48.514,17.78; 151 45.974,15.24; 152 48.514,15.24; 153 45.974,12.7; 154 48.514,12.7; 155 45.974,10.16; 156 48.514,10.16 | hole 3.048: 17.526,94.234; 48.641,2.54
2X11 = drill 1.016 octagon: 1 -12.7,-1.27; 2 -12.7,1.27; 3 -10.16,-1.27; 4 -10.16,1.27; 5 -7.62,-1.27; 6 -7.62,1.27; 7 -5.08,-1.27; 8 -5.08,1.27; 9 -2.54,-1.27; 10 -2.54,1.27; 11 0,-1.27; 12 0,1.27; 13 2.54,-1.27; 14 2.54,1.27; 15 5.08,-1.27; 16 5.08,1.27; 17 7.62,-1.27; 18 7.62,1.27; 19 10.16,-1.27; 20 10.16,1.27; 21 12.7,-1.27; 22 12.7,1.27
1X08 = drill 1.016 long: 1 -8.89,0; 2 -6.35,0; 3 -3.81,0; 4 -1.27,0; 5 1.27,0; 6 3.81,0; 7 6.35,0; 8 8.89,0
1X04 = drill 1.016 long: 1 -3.81,0; 2 -1.27,0; 3 1.27,0; 4 3.81,0
JP2 = drill 0.914 long: 1 -2.54,0; 2 0,0; 3 2.54,0
2X08 = drill 1.016 octagon: 1 -8.89,-1.27; 2 -8.89,1.27; 3 -6.35,-1.27; 4 -6.35,1.27; 5 -3.81,-1.27; 6 -3.81,1.27; 7 -1.27,-1.27; 8 -1.27,1.27; 9 1.27,-1.27; 10 1.27,1.27; 11 3.81,-1.27; 12 3.81,1.27; 13 6.35,-1.27; 14 6.35,1.27; 15 8.89,-1.27; 16 8.89,1.27
M9040P = drill 1.803 long: 1 0,4.699; 2 0,0; 3 0,-4.699
2X05 = drill 1.016 octagon: 1 -5.08,-1.27; 2 -5.08,1.27; 3 -2.54,-1.27; 4 -2.54,1.27; 5 0,-1.27; 6 0,1.27; 7 2.54,-1.27; 8 2.54,1.27; 9 5.08,-1.27; 10 5.08,1.27
2X06 = drill 1.016 octagon: 1 -6.35,-1.27; 2 -6.35,1.27; 3 -3.81,-1.27; 4 -3.81,1.27; 5 -1.27,-1.27; 6 -1.27,1.27; 7 1.27,-1.27; 8 1.27,1.27; 9 3.81,-1.27; 10 3.81,1.27; 11 6.35,-1.27; 12 6.35,1.27
R1206 = smd 1.6 x 1.803: 1 -1.422,0; 2 1.422,0
1X03' = drill 0.8 pad 1.4 long: 1 -2,-0.38; 2 0,-0.38; 3 2,-0.38
DEANS = drill 1.27 pad 3.556 long: + 0,0; - 0.737,-6.921

### Placement (x,y rotation side)
ADCX1  136.28,67.38 270 top
ARDU_CAM  75,12.13 0 top
BUZZ_TRN  46.11,135.01 0 top
BUZZER  46.11,135.01 270 bottom
CLAP_DET  96.59,127.39 90 top
D1  75,127.7 90 top
ESP_GPIO2  23.56,40.39 0 top
ESP_GPIO3  23.56,109.61 0 top
EYFI_MEGA  21.02,107.07 270 top
GPIO1  98.18,114.37 180 top
GPIO3  98.18,35.63 180 top
GY-87  81.98,75 90 bottom
I2C1  126.43,40.39 180 top
I2C_HEADER_1  115,27.69 180 top
I2C_HEADER_2  101.35,27.69 180 top
INTX1  126.43,109.61 180 top
JP1  75,143.26 180 top
JP2  90.24,136.59 270 top
JP3  60.39,137.86 180 top
JP4  60.39,127.7 0 top
JP5  91.51,22.29 0 top
JP6  91.51,16.9 0 top
JP7  91.51,11.5 180 top
JP8  143.26,75 270 top
JP9  75,6.74 0 top
JP10  10.86,58.49 0 top
LINE_FOLLOWER_HEADER  101.35,11.5 0 top
MOTOR_DRIVER  136.28,92.78 270 top
OLED_1  101.35,22.29 0 top
OLED_2  101.35,16.9 0 top
PIR  91.51,127.39 90 top
POWER_SWITCH  57.22,22.93 90 top
PWM1_1  43.25,35.63 180 top
PWM1_2  43.25,114.37 180 top
R1  71.51,130.25 180 top
R2  71.51,132.78 180 top
R3  78.49,130.25 0 top
R4  78.49,125.16 0 top
R5  78.49,122.62 0 top
R6  71.51,125.16 0 top
R7  71.51,122.62 0 top
R8  78.49,132.78 180 top
R9  42.61,132.47 90 top
R10  72.46,21.66 90 top
R11  75,21.66 90 top
R12  77.54,21.66 270 top
SERVO_1  95.64,136.59 90 top
SERVO_2  101.03,136.59 90 top
SERVO_3  106.43,136.59 90 top
SH_1  102.3,127.39 90 top
SH_2  107.7,127.39 90 top
SHARP_1  [1X03']  75,147.71 0 bottom
SHARP_2  [1X03']  147.07,75 270 bottom
SHARP_3  [1X03']  75,2.29 180 bottom
SHARP_4  [1X03']  2.93,75 90 bottom
SPI1  74.05,35.63 180 top
U$1  57.22,13.09 270 top
UART1  74.05,114.37 180 top
ULTRASONIC  60.39,142.31 0 top

### Tracks (layer width: path | path; a pad name or v marks a point on that pad's centre or on a via)
+3.3V
  Top 0.813: EYFI_MEGA.62 EYFI_MEGA.61 EYFI_MEGA.60 EYFI_MEGA.59 EYFI_MEGA.58 EYFI_MEGA.57 | EYFI_MEGA.53 EYFI_MEGA.54 EYFI_MEGA.55 EYFI_MEGA.56
  Bottom 0.305: ARDU_CAM.17 85.15,10.83 83.89,9.57 82.21,9.57 81.38,10.41 81.38,11.25 80.54,12.08 66.85,12.08 65.73,10.97 64.89,10.97 ARDU_CAM.1 64.75,10.97 55.95,19.77 51.76,19.77 39.46,32.06 39.46,57.49 45.47,63.49 EYFI_MEGA.62
  Bottom 0.813: EYFI_MEGA.56 EYFI_MEGA.57
+5V  (via drill 0.35)
  Top 0.813: JP8.2 JP8.3 143.12,72.15 143.12,59.44 128.45,44.77 | ADCX1.1 135.02,78.86 137.53,78.86 ADCX1.2 | INTX1.2 130.27,108.34 130.27,110.85 INTX1.1 | EYFI_MEGA.133 122.17,94.79 120.49,93.11 EYFI_MEGA.134 120.77,92.83 121.19,92.41 121.19,86.96 EYFI_MEGA.132 121.19,86.54 123.56,86.54 EYFI_MEGA.131 123.98,86.68 126.27,88.97 MOTOR_DRIVER.11 MOTOR_DRIVER.12 | JP5.1 89.06,22.28 91.43,22.28 JP5.2 | JP9.2 75.09,6.78 77.46,6.78 JP9.3 77.88,6.91 84.31,6.91 88.64,11.25 JP7.3 89.06,11.52 91.43,11.52 JP7.2 | EYFI_MEGA.112 120.49,56.93 122.03,55.39 EYFI_MEGA.111 122.31,54.97 122.31,50.92 128.45,44.77 | I2C1.2 130.27,39.19 130.27,41.56 I2C1.1 129.99,41.98 129.99,43.24 128.45,44.77 | SH_1.3 102.33,129.99 107.64,129.99 SH_2.3 | JP1.2 JP1.3 72.15,143.12 71.52,143.12 66.26,137.86 JP3.1 62.93,137.95 60.7,137.95 JP3.2 60.28,137.81 60.28,136.58 58.86,135.16 56.97,135.16 56.03,136.11 BUZZ_TRN.C | PWM1_2.2 49.66,113.23 49.66,115.6 PWM1_2.1 | 67.68,99.12 67.68,101.49 EYFI_MEGA.33 67.82,101.91 67.82,112.81 UART1.12 67.68,113.23 67.68,115.6 UART1.11 | 67.68,99.12 EYFI_MEGA.34 | JP10.2 10.97,58.6 13.34,58.6 JP10.3 13.76,58.6 16.63,58.6 21.34,63.31 42.57,63.31 44.1,61.78 v46.09,61.78 | GPIO3.21 85.43,36.81 85.43,34.44 GPIO3.22 85.48,32.11 | EYFI_MEGA.83 85.57,48.41 85.57,50.92 EYFI_MEGA.84 | 48.41,35.69 48.41,36.81 PWM1_1.1 48.13,37.23 46.73,38.63 46.73,55.49 52.32,61.08 52.32,64.89 EYFI_MEGA.52 | 48.41,35.69 48.41,34.44 PWM1_1.2 | EYFI_MEGA.72 67.68,50.78 67.68,48.41 EYFI_MEGA.71 67.82,47.99 67.82,37.23 SPI1.11 67.68,36.81 67.68,35.69 | 67.68,35.69 67.68,34.44 SPI1.12 67.7,33.67 69.26,32.11 85.48,32.11
  Top 0.813: 67.68,35.69 48.41,35.69 | GY-87.1 81.93,66.15 74.16,66.15 66.59,73.72 66.59,98.02 67.68,99.12 | v90.01,29.07 86.98,32.11 85.48,32.11 | JP2.2 JP2.3 | EYFI_MEGA.22 EYFI_MEGA.21 85.54,113.04 GPIO1.22 GPIO1.21 85.48,127.39 88.02,129.93 PIR.3
  Bottom 0.813: JP8.2 143.26,75.09 141.31,75.09 137.67,78.72 ADCX1.2 137.95,79 139.07,80.12 139.07,87.76 137.86,88.97 MOTOR_DRIVER.12 | INTX1.1 130.13,110.99 129.71,110.99 128.31,112.39 122.03,112.39 113.51,103.87 113.51,97.86 118.26,93.11 120.35,93.11 EYFI_MEGA.134 | JP5.1 88.92,22.28 88.92,19.63 87.52,18.23 87.52,12.92 88.92,11.52 JP7.3 | I2C1.2 130.13,39.05 118.95,27.87 I2C_HEADER_1.1 118.81,26.58 117.33,25.1 110.02,25.1 107.42,27.69 I2C_HEADER_2.1 105.16,28.84 104.04,29.97 97.02,29.97 93.07,26.01 | 93.07,26.01 91.57,24.52 91.57,22.42 JP5.2 | PWM1_2.2 49.66,113.09 67.68,113.09 UART1.12 | JP3.2 60.28,137.81 60.28,132.78 49.66,122.17 49.66,115.74 PWM1_2.1 | GPIO1.21 85.43,115.74 83.47,115.74 77.46,121.75 73.83,121.75 67.82,115.74 UART1.11 | EYFI_MEGA.52 EYFI_MEGA.51 49.86,64.46 47.19,61.78 v46.09,61.78 | GY-87.1 82.07,66.01 82.07,54.41 85.43,51.06 EYFI_MEGA.84 | GPIO3.21 85.43,36.95 85.43,48.27 EYFI_MEGA.83 | v90.01,29.07 93.07,26.01 | JP2.3 91.51,132.78 PIR.3 CLAP_DET.3 SH_1.3
+12V  (via drill 0.35)
  Top 1.27: MOTOR_DRIVER.13 135.02,86.4 137.53,86.4 MOTOR_DRIVER.14 | v95.34,64.47 v119.09,88.22 | v83.47,64.47 83.19,64.19 v76.35,64.19
  Bottom 1.27: POWER_SWITCH.1 52.52,48.08 54.1,49.66 | EYFI_MEGA.64 EYFI_MEGA.66 EYFI_MEGA.65 EYFI_MEGA.63 | EYFI_MEGA.64 | EYFI_MEGA.64 EYFI_MEGA.63 | EYFI_MEGA.63 | v119.09,88.22 124.26,88.22 125.94,86.54 134.88,86.54 MOTOR_DRIVER.13 | v83.47,64.47 v95.34,64.47 | v76.35,64.19 68.66,64.19 56.37,51.9 EYFI_MEGA.64
  Bottom 2.54: 54.1,49.66 EYFI_MEGA.63
+VE_BTRY
  Top 1.27: U$1.+ POWER_SWITCH.2 POWER_SWITCH.3
ADC0  (via drill 0.35)
  Top 0.305: ADCX1.3 134.88,76.35 130.41,76.35 123.98,82.77 123.15,82.77 121.61,84.31 EYFI_MEGA.130 121.19,84.03 122.31,85.15 123.98,85.15 126.5,87.66 138.19,87.66 139.51,88.98 139.51,105.01 126.18,118.34 115,118.34 111.43,121.91 v111.43,134.53
  Bottom 0.305: v111.43,134.53 108.1,137.86 105,137.86 102.01,140.86 77.21,140.86 76.27,141.8 76.27,144.93 75,146.2 SHARP_1.2
ADC1
  Top 0.305: SHARP_2.2 147.31,75.09 145.5,75.09 144.38,76.21 137.67,76.21 ADCX1.4 137.53,76.35 136.42,77.46 134.6,77.46 128.17,83.89 123.7,83.89 EYFI_MEGA.129
ADC2
  Top 0.305: SHARP_3.2 75.09,2.72 75.09,3.62 76.13,4.66 84.55,4.66 89.25,9.36 100.44,9.36 101.35,10.27 101.35,23.54 103.45,25.63 105.54,25.63 112.52,32.61 112.52,72.84 121.05,81.38 EYFI_MEGA.128 121.19,81.38 122.45,80.12 124.12,80.12 130.41,73.83 134.88,73.83 ADCX1.5
ADC3  (via drill 0.35)
  Top 0.305: v79.14,76.35 79.56,76.35 80.68,77.46 v90.18,77.46 | v115.46,77.46 120.63,82.63 122.45,82.63 123.56,81.51 EYFI_MEGA.127 123.7,81.38 129.99,75.09 135.44,75.09 136.7,73.83 137.53,73.83 ADCX1.6
  Top 0.406: SHARP_4.2 4.83,75 8.32,78.49 8.32,83.65 11.18,86.51 33.88,86.51 42.85,77.54 46.35,77.54 47.54,76.35 v55.67,76.35
  Bottom 0.305: v115.46,77.46 v90.18,77.46
  Bottom 0.406: v79.14,76.35 v55.67,76.35
ADC4
  Bottom 0.305: ADCX1.7 134.37,71.19 127.96,77.6 123.15,77.6 121.89,78.86 121.19,78.86 EYFI_MEGA.126
ADC5
  Top 0.305: EYFI_MEGA.125 123.7,78.86 124.54,78.86 130.97,72.43 136.42,72.43 137.53,71.32 ADCX1.8
ADC6
  Bottom 0.305: EYFI_MEGA.124 121.19,76.21 122.03,76.21 123.15,75.09 127.77,75.09 134.21,68.65 ADCX1.9
ADC7
  Bottom 0.305: ADCX1.10 136.83,68.65 135.56,69.92 134.28,69.92 128,76.21 123.7,76.21 EYFI_MEGA.123
ADC8
  Top 0.305: ADCX1.11 134.98,66.13 134.47,66.13 128.09,72.51 122.38,72.51 EYFI_MEGA.122
ADC9
  Top 0.305: EYFI_MEGA.121 128.07,73.79 134.46,67.4 136.25,67.4 ADCX1.12
ADC10
  Top 0.305: EYFI_MEGA.120 121.1,71.23 122.33,70 127.7,70 134.13,63.57 ADCX1.13
ADC11
  Top 0.305: EYFI_MEGA.119 127.94,71.25 134.36,64.83 136.29,64.83 ADCX1.14
ADC12
  Top 0.305: EYFI_MEGA.118 122.33,67.48 127.24,67.48 133.7,61.03 ADCX1.15
  Bottom 0.305: SH_2.2 109.13,127.39 111.59,125.75 119.88,125.75 140.35,105.28 140.35,82.75 145.22,77.88 145.22,66.99 138.09,59.86 136.14,59.86 135.02,60.98 ADCX1.15
ADC13
  Top 0.305: EYFI_MEGA.117 127.49,68.71 133.89,62.32 136.26,62.32 ADCX1.16
  Bottom 0.305: SH_1.2 102.33,127.34 102.75,127.34 112.95,117.14 127.34,117.14 139.43,105.05 139.43,91.49 138.19,90.26 136.82,90.26 136.28,89.72 136.28,70.6 136.96,69.92 138.19,69.92 138.95,69.16 138.95,62.39 137.67,61.12 ADCX1.16
ADC14
  Top 0.305: ADCX1.17 133.5,58.49 127.06,64.93 122.34,64.93 EYFI_MEGA.116
  Bottom 0.305: CLAP_DET.2 96.46,127.34 94.37,125.24 94.37,104.7 97.02,102.05 97.02,97.86 119.93,74.95 119.93,67.4 121.1,66.24 EYFI_MEGA.116
ADC15
  Top 0.305: EYFI_MEGA.115 127.2,66.17 133.57,59.8 136.24,59.8 ADCX1.18
  Bottom 0.305: PIR.2 91.57,127.34 93.53,125.38 93.53,117.84 91.85,116.16 91.85,104.7 94.51,102.05 94.51,98.7 114.9,78.3 115.74,78.3 119.37,74.67 119.37,66.15 120.63,64.89 122.36,64.89 EYFI_MEGA.115
ESP_D5
  Top 0.305: EYFI_MEGA.143 36.25,91.57 36.25,97.72 26.05,107.92 26.05,109.73 24.94,110.85 ESP_GPIO3.6
ESP_D12
  Top 0.305: EYFI_MEGA.149 38.77,60.98 38.77,60.28 37.51,59.02 37.51,51.76 27.45,41.7 ESP_GPIO2.8
ESP_D13
  Top 0.305: EYFI_MEGA.141 38.77,91.57 38.77,99.54 27.45,110.85 ESP_GPIO3.8
ESP_D14
  Top 0.305: EYFI_MEGA.150 38.77,58.46 38.77,50.5 27.45,39.19 ESP_GPIO2.7
ESP_D19
  Top 0.305: EYFI_MEGA.146 32.48,90.28 32.48,98.12 22.29,108.31 ESP_GPIO3.3
ESP_D21
  Bottom 0.305: EYFI_MEGA.145 33.6,91.57 33.6,97.86 23.54,107.92 23.54,109.73 22.42,110.85 ESP_GPIO3.4
ESP_D22
  Top 0.305: ESP_GPIO3.1 19.77,107.64 29.81,97.6 29.81,90.4 EYFI_MEGA.148
ESP_D23
  Top 0.305: EYFI_MEGA.147 31.08,91.57 31.08,97.86 21.02,107.92 21.02,109.59 19.77,110.85 ESP_GPIO3.2
ESP_D25
  Top 0.305: EYFI_MEGA.152 36.25,58.46 36.25,52.32 26.05,42.12 26.05,40.3 24.94,39.19 ESP_GPIO2.5
ESP_D26
  Bottom 0.305: EYFI_MEGA.151 36.25,60.98 36.25,60.28 34.99,59.02 34.99,51.76 24.94,41.7 ESP_GPIO2.6
ESP_D34
  Top 0.305: EYFI_MEGA.154 33.6,58.46 33.6,52.18 23.54,42.12 23.54,40.3 22.42,39.19 ESP_GPIO2.3
ESP_D35
  Bottom 0.305: EYFI_MEGA.153 33.6,60.98 33.6,60.14 32.48,59.02 32.48,51.76 22.42,41.7 ESP_GPIO2.4
ESP_RX2
  Top 0.305: EYFI_MEGA.142 38.8,89.06 37.51,90.36 37.51,98.2 ESP_GPIO3.7
ESP_TX2
  Bottom 0.305: EYFI_MEGA.144 36.24,89.03 34.99,90.28 34.99,98.12 24.83,108.28 ESP_GPIO3.5
ESP_VN
  Top 0.813: EYFI_MEGA.155 30.55,61.73 21.77,61.73 19.77,59.72 19.77,41.7 ESP_GPIO2.2
ESP_VP
  Bottom 0.813: EYFI_MEGA.156 31.08,58.46 31.08,55.11 18.23,42.26 18.23,40.58 19.63,39.19 ESP_GPIO2.1
GND  (via drill 0.35)
  Top 2.54: U$1.- 44.94,12.35 44.84,12.45 | U$1.- 50.3,15.56 50.23,15.63 | U$1.- 50.23,12.29 50.23,8.32
  other vias: 59.6,92.3 69.76,92.3 73.57,92.3 77.38,97.07 69.44,110.72 63.73,110.72 85.56,131.04 27.61,60.16 27.06,54.92 63.73,115.48 71.59,139.85 67.22,142.79 84.84,144.22 91.35,92.3 38.01,66.59 38.01,78.65 96.43,118.97 52.62,87.22 49.76,87.22 84.68,30.71 85.32,24.99 86.91,26.58 88.49,28.17 78.97,24.99
  pour Top (isolate 0.305, hatched): 75,149.93 arc-90 149.93,75 arc-90 75,0.07 arc-90 0.07,75 arc-90
  pour Bottom (isolate 0.305, hatched): 75,149.93 arc-90 149.93,75 arc-90 75,0.07 arc-90 0.07,75 arc-90
INT4
  Top 0.305: EYFI_MEGA.135 120.49,96.6 129.16,96.6 134.19,91.57 134.88,91.57 MOTOR_DRIVER.9
  Bottom 0.305: INTX1.3 127.62,110.85 127.62,110.01 126.36,108.76 126.36,102.61 120.49,96.74 EYFI_MEGA.135
INT5
  Bottom 0.305: 126.29,100.86 127.62,102.19 127.62,108.34 INTX1.4 | 126.29,100.86 120.35,94.93 118.67,94.93 EYFI_MEGA.136 | 126.29,100.86 134.32,92.83 135.44,92.83 136.7,91.57 137.53,91.57 MOTOR_DRIVER.10
INT6
  Top 0.305: MOTOR_DRIVER.7 134.88,94.09 134.1,94.09 129.77,98.42 118.67,98.42 EYFI_MEGA.137
  Bottom 0.305: EYFI_MEGA.137 118.67,98.56 118.67,102.61 123.98,107.92 123.98,109.73 125.1,110.85 INTX1.5
INT7
  Top 0.305: 123.97,105.67 125.1,106.8 125.1,108.34 INTX1.6 | 123.97,105.67 116.86,98.56 116.86,96.74 EYFI_MEGA.138 | 123.97,105.67 134.3,95.34 136.25,95.34 MOTOR_DRIVER.8
MISO
  Bottom 0.305: EYFI_MEGA.80 77.88,50.78 77.88,49.94 76.63,48.69 76.63,38.07 77.74,36.95 SPI1.3
MOSI
  Top 0.305: EYFI_MEGA.78 75.23,50.78 75.23,49.8 74.11,48.69 74.11,38.07 75.23,36.95 SPI1.5
N$1
  Top 0.813: SHARP_1.1 77.54,146.79 JP1.1
N$2
  Top 0.305: R1.2 70.06,130.27 67.4,130.27 D1.7
N$3
  Top 0.305: BUZZ_TRN.E 47.01,133.9 47.01,132.09 46.17,131.25 BUZZER.+
N$4
  Top 0.305: D1.6 R2.2
N$5
  Top 0.305: BUZZ_TRN.B 45.05,133.9 42.68,133.9 R9.2
N$6
  Top 0.305: R3.2 79.98,130.27 82.49,130.27 D1.4
N$7
  Top 0.305: R4.2 79.98,125.24 82.49,125.24 D1.2
N$8
  Top 0.305: R5.2 79.98,122.59 82.49,122.59 D1.1
N$9
  Top 0.305: R6.1 70.06,125.24 67.4,125.24 D1.9
N$10
  Top 0.305: R7.1 70.06,122.59 67.4,122.59 D1.10
N$11
  Top 0.305: D1.5 R8.1
N$12
  Top 0.813: JP3.3 56.57,139.15 56.57,142.29 ULTRASONIC.1
N$13
  Top 0.305: D1.8 67.27,127.76 62.93,127.76 JP4.3
  Bottom 0.305: D1.3 82.49,127.76 67.4,127.76 D1.8
N$14
  Top 0.813: JP5.3 94.09,22.28 97.44,22.28 OLED_1.1 97.58,22 97.58,16.97 OLED_2.1
N$15
  Bottom 0.305: 98,18.93 97.02,18.93 95.07,16.97 94.09,16.97 JP6.3 | 98,18.93 99.95,16.97 OLED_2.2 | OLED_1.2 99.95,22.28 99.95,21.02 98,19.07 98,18.93
N$16
  Top 0.305: JP7.1 94.09,11.52 97.44,11.52 LINE_FOLLOWER_HEADER.1
N$17
  Top 0.305: R11.2 75.09,23.12 77.46,23.12 R12.1
N$18
  Top 0.813: SHARP_2.1 147.31,77.04 143.68,77.04 143.26,77.46 JP8.1
N$19
  Top 0.813: SHARP_4.1 4.85,73 8.32,69.52 JP10.1
N$22
  Top 0.813: SHARP_3.1 72.99,2.72 72.99,6.22 72.57,6.64 JP9.1
N$23
  Top 0.813: JP2.1 90.3,139.21 95.61,139.21 SERVO_1.3 96.03,139.21 100.92,139.21 SERVO_2.3 101.34,139.21 106.37,139.21 SERVO_3.3
OC0A  (via drill 0.35)
  Top 0.305: EYFI_MEGA.47 51.16,68.66 52.88,68.66 53.57,67.96 53.57,58.04 v48.69,53.16
  Bottom 0.305: v48.69,53.16 48.69,41.56 44.49,37.37 44.49,35.55 43.38,34.44 PWM1_1.6
OC0B
  Bottom 0.305: EYFI_MEGA.46 52.46,72.43 52.46,71.6 53.57,70.48 53.57,61.68 40.72,48.82 40.72,36.95 PWM1_1.7
OC1A
  Bottom 0.305: EYFI_MEGA.44 52.32,74.95 51.48,74.95 50.36,73.83 49.38,73.83 48.69,74.53 48.69,109.73 45.89,112.53 45.89,114.48 47.01,115.6 PWM1_2.3
OC1B
  Top 0.305: EYFI_MEGA.45 49.84,72.51 47.01,69.68 47.01,58.94 41.98,53.91 41.98,35.61 40.73,34.36 PWM1_1.8 40.71,33.72 41.33,33.1 55.61,33.1 68.66,20.05 68.66,10.25 69.34,9.57 71.13,9.57 72.39,10.83 72.43,10.83 ARDU_CAM.7
OC2A  (via drill 0.35)
  Top 0.305: v51.06,106.95 51.06,109.1 PWM1_2.4
  Bottom 0.305: v51.06,106.95 51.06,77.04 49.94,75.93 49.94,75.09 EYFI_MEGA.43
OC2B  (via drill 0.35)
  Top 0.305: v72.43,27.87 72.43,23.12 R10.2 | v57.07,43.24 57.07,76.46 56.07,77.46 54.61,77.46 | 54.61,77.46 52.46,77.46 EYFI_MEGA.42 | 54.61,77.46 54.61,102.09 45.81,110.89 45.81,114.35 PWM1_2.5
  Bottom 0.305: v57.07,43.24 v72.43,27.87
OC3A
  Top 0.305: R9.1 42.54,130.97 42.54,118.81 39.46,115.74 PWM1_2.9 39.44,115.63 40.72,114.34 40.72,112.35 51.06,102.01 51.06,84.07 52.4,82.73 EYFI_MEGA.38
OC4A
  Top 0.305: EYFI_MEGA.39 51.1,81.38 53.11,81.38 53.89,82.15 53.89,100.7 41.98,112.61 PWM1_2.8 43.24,114.36 43.24,124.64 51.69,133.09 63.2,133.09 67.93,137.81 92.69,137.81 93.91,136.59 SERVO_1.2
OC4B  (via drill 0.35)
  Top 0.305: EYFI_MEGA.40 52.4,80.11 51.16,78.86 48.35,78.86 v47.01,80.2
  Bottom 0.305: v47.01,80.2 47.01,108.9 43.24,112.67 43.24,114.42 42.02,115.64 PWM1_2.7 41.98,115.9 59.02,132.94 59.02,138.87 59.92,139.77 64.07,139.77 65.88,137.95 99.67,137.95 101.02,136.59 SERVO_2.2
OC4C  (via drill 0.35)
  Top 0.305: v47.85,78.25 48.49,77.6 49.8,77.6 EYFI_MEGA.41
  Bottom 0.305: v47.85,78.25 47.85,109.73 44.49,113.09 PWM1_2.6 44.63,113.23 44.63,114.06 45.75,115.18 45.75,116.02 46.59,116.86 47.57,116.86 48.27,116.16 48.27,115.18 49.1,114.34 52.77,114.34 65.24,126.82 65.24,128.07 66.13,128.95 68.32,128.95 74.67,135.3 105.11,135.3 106.38,136.56 SERVO_3.2
OC5A  (via drill 0.35)
  Top 0.305: 54.13,70 54.13,55.11 v47.85,48.82 | 54.13,70 54.13,71.12 55.05,72.03 v55.76,72.03 | v94.51,81.1 112.11,98.7 112.11,99.54 122.17,109.59 125.66,109.59 126.36,108.9 126.36,105.23 135,96.59 MOTOR_DRIVER.5 | v84.17,81.1 83.05,79.98 79.56,79.98 v71.6,72.01 | EYFI_MEGA.48 54.1,69.97 54.13,70
  Bottom 0.305: v47.85,48.82 47.85,41.56 43.24,36.95 PWM1_1.5 | v84.17,81.1 v94.51,81.1 | v71.6,72.01 55.78,72.01 v55.76,72.03
OC5B  (via drill 0.35)
  Top 0.305: EYFI_MEGA.49 49.79,67.43 47.57,65.2 47.57,58.58 44.49,55.51 44.49,35.69 45.75,34.44 PWM1_1.4 | MOTOR_DRIVER.6 138.79,95.34 138.79,93.37 138.19,92.77 137.06,92.77 136.28,91.99 136.28,91.01 135.58,90.32 128.45,90.32 122.73,96.04 121.47,96.04 117.7,92.27 109.59,92.27 v92.69,75.37 | v83.75,75.37 83.33,74.95 v75.65,74.95
  Bottom 0.305: v83.75,75.37 v92.69,75.37 | v75.65,74.95 53.99,74.95 52.74,73.69 51.9,73.69 51.06,72.85 51.06,68.66 49.94,67.54 EYFI_MEGA.49
OC5C
  Top 0.305: EYFI_MEGA.50 52.31,67.43 51.06,66.18 51.06,61.16 45.89,55.99 45.89,36.95 PWM1_1.3
PA0
  Top 0.305: EYFI_MEGA.102 107.22,49.76 107.22,36.9 | ARDU_CAM.16 82.63,13.48 82.63,17.97 96.72,32.06 102.75,32.06 104.57,33.88 104.57,34.85 105.4,35.69 106.7,35.69 107.22,36.21 107.22,36.9 | GPIO3.3 107.22,36.9
PA1
  Top 0.305: GPIO3.4 109.59,35.61 109.59,37.37 108.48,38.49 108.48,48.27 EYFI_MEGA.101
  Bottom 0.305: ARDU_CAM.15 82.63,10.97 82.63,11.66 83.89,12.92 83.89,25.08 88.72,29.91 95.71,29.91 97.3,31.5 105.54,31.5 108.34,34.3 GPIO3.4
PA2
  Bottom 0.305: EYFI_MEGA.100 105.82,50.92 105.82,50.08 104.57,48.82 104.57,38.7 105.8,37.47 GPIO3.5 104.93,36.9 103.73,35.69 102.89,35.69 101.97,34.78 101.97,33.94 100.09,32.06 97.02,32.06 95.51,30.55 88.52,30.55 80.12,22.14 80.12,13.48 ARDU_CAM.14
PA3  (via drill 0.35)
  Top 0.305: v86.54,10.55 85.57,9.57 82.21,9.57 80.96,10.83 80.12,10.83 ARDU_CAM.13 | v86.4,16.69 90.18,20.47 91.99,20.47 92.83,21.3 92.83,27.16 97.17,31.5 103.81,31.5 105.8,33.49 GPIO3.6
  Bottom 0.305: EYFI_MEGA.99 105.96,48.27 105.96,38.49 107.08,37.37 107.08,35.64 GPIO3.6 | v86.54,10.55 86.54,16.55 v86.4,16.69
PA4
  Top 0.305: EYFI_MEGA.98 102.05,49.66 102.05,38.62 103.26,37.42 GPIO3.7
  Bottom 0.305: GPIO3.7 101.97,35.61 100.29,35.61 99.54,34.85 99.54,34.02 98.7,33.18 96.46,33.18 95.9,32.62 89.76,32.62 77.6,20.47 77.6,13.48 ARDU_CAM.12
PA5  (via drill 0.35)
  Top 0.305: EYFI_MEGA.97 103.45,48.27 103.45,38.65 104.43,37.67 104.43,36.19 103.26,35.02 GPIO3.8 | v73.83,17.53 73.83,10.27 74.53,9.57 75.37,9.57 76.63,10.83 77.46,10.83 ARDU_CAM.11
  Bottom 0.305: v73.83,17.53 89.48,33.18 93.67,33.18 94.37,33.88 94.37,43.82 97.02,46.48 97.02,49.06 97.62,49.66 102.61,49.66 103.32,48.95 EYFI_MEGA.97
PA6
  Top 0.305: ARDU_CAM.10 75.71,14.12 76.24,14.12 94.74,32.62 98.14,32.62 99.54,34.02 99.54,36.9 | 99.54,36.9 99.54,49.7 EYFI_MEGA.96 | GPIO3.9 99.54,36.9
PA7  (via drill 0.35)
  Top 0.305: GPIO3.10 101.99,35.63 101.99,37.53 100.79,38.73 100.79,48.27 EYFI_MEGA.95 | ARDU_CAM.9 76.27,12.13 78.02,12.13 78.81,12.93 78.81,15.71 94.88,31.78 v95.18,31.78
  Bottom 0.305: v95.18,31.78 95.9,31.78 96.74,32.62 98.98,32.62 GPIO3.10
PB1
  Top 0.305: SPI1.8 73.97,35.55 73.97,37.37 72.85,38.49 72.85,48.27 EYFI_MEGA.75
PB2
  Bottom 0.305: EYFI_MEGA.77 75.23,48.27 75.23,38.49 74.11,37.37 74.11,35.55 75.23,34.44 SPI1.6
PB3
  Top 0.305: EYFI_MEGA.79 77.88,48.27 77.88,38.63 76.63,37.37 76.63,35.55 77.74,34.44 SPI1.4
PC0
  Top 0.305: R1.1 73.01,130.25 74.99,132.23 74.99,133.27 75.91,134.18 78.02,134.18 78.58,133.62 78.58,120.07 84.31,114.34 84.31,98.7 85.01,98 104.7,98 105.82,99.12 EYFI_MEGA.6
  Bottom 0.305: GPIO1.6 105.82,113.09 105.82,103.45 107.08,102.19 107.08,100.38 105.96,99.26 EYFI_MEGA.6
PC1  (via drill 0.35)
  Top 0.305: R2.1 72.96,132.78 74.91,134.74 84.69,134.74 88.32,131.11 92.83,131.11 94.65,129.29 94.65,124.26 v101.35,117.56 | EYFI_MEGA.5 105.96,101.77 105.96,101.79 107.08,102.9 107.08,114.34 105.82,115.6 GPIO1.5
  Bottom 0.305: v101.35,117.56 103.87,117.56 105.68,115.74 GPIO1.5
PC2  (via drill 0.35)
  Top 0.305: v77.18,126.78 77.18,130.13 R3.1 | v94.09,96.6 105.82,96.6 108.34,99.12 EYFI_MEGA.4
  Bottom 0.305: v77.18,126.78 77.18,125.66 86.82,116.02 86.82,101.21 87.66,100.38 91.15,100.38 91.99,99.54 91.99,98.7 v94.09,96.6 | GPIO1.4 108.34,103.45 109.59,102.19 109.59,100.38 108.48,99.26 EYFI_MEGA.4
PC3
  Top 0.305: R4.1 77.04,125.1 75.79,123.84 75.79,120.91 79.84,116.86 80.96,116.86 83.75,114.06 83.75,98.42 84.73,97.44 105.82,97.44 107.22,98.84 107.22,100.51 108.34,101.63 EYFI_MEGA.3 108.48,101.77 109.59,102.89 109.59,114.38 GPIO1.3
PC4  (via drill 0.35)
  Top 0.305: v77.18,120.63 77.18,122.59 R5.1 | v84.31,84.45 91.01,77.74 v91.01,53.02
  Bottom 0.305: v77.18,120.63 84.31,113.51 v84.31,84.45 | v91.01,53.02 89.34,51.34 89.34,49.66 88.08,48.41 EYFI_MEGA.85 88.08,48.27 89.2,47.15 89.2,36.39 88.08,35.27 88.08,34.44 GPIO3.20
PC5  (via drill 0.35)
  Top 0.305: v71.6,73.13 71.6,123.84 72.85,125.1 R6.2 | v79.42,59.72 88.08,51.06 EYFI_MEGA.86 87.94,50.92 86.82,49.8 86.82,47.99 87.94,46.87 87.94,36.95 GPIO3.19
  Bottom 0.305: v71.6,73.13 79.42,65.31 v79.42,59.72
PC6
  Top 0.305: R7.2 72.99,122.59 72.99,122.17 79.14,116.02 79.14,90.73 91.85,78.02 91.85,50.3 90.62,49.07 EYFI_MEGA.87 90.62,47.8 91.85,46.43 91.85,35.66 GPIO3.18
PC7
  Top 0.305: R8.2 76.93,132.78 75.28,131.14 75.28,129.71 72.07,126.5 66.43,126.5 65.59,125.66 65.59,73.41 78.44,60.56 81.1,60.56 90.6,51.06 EYFI_MEGA.88 90.6,50.78 89.34,49.52 89.34,47.99 90.46,46.87 90.46,36.95 GPIO3.17
PD0
  Top 0.305: I2C1.6 123.98,40.3 123.98,41.98 118.67,47.29 118.67,51.62 EYFI_MEGA.107
PD1
  Bottom 0.305: EYFI_MEGA.109 120.49,53.43 120.49,48.69 126.5,42.68 126.5,40.3 127.62,39.19 I2C1.4
PD4
  Top 0.305: EYFI_MEGA.12 98.24,99.2 97.02,100.42 97.02,110.62 98.18,111.78 GPIO1.12 98.28,113.23 99.4,114.34 101.21,114.34 101.91,115.04 101.91,116.02 102.75,116.86 120.91,116.86 126.36,111.41 126.36,110.43 127.2,109.59 128.17,109.59 128.87,108.9 128.87,107.78 134.88,101.77 MOTOR_DRIVER.1
PD5
  Bottom 0.305: EYFI_MEGA.11 98.14,101.77 98.14,111.41 96.88,112.67 96.88,114.34 GPIO1.11 100.93,118.4 109.87,118.4 111.69,116.58 127.06,116.58 137.53,106.1 137.53,101.77 MOTOR_DRIVER.2
PD6
  Top 0.305: GPIO1.10 100.72,112.44 99.54,111.25 99.54,100.42 100.65,99.3 100.65,99.26 EYFI_MEGA.10
  Bottom 0.305: MOTOR_DRIVER.3 134.88,99.26 134.88,100.09 131.53,103.45 131.53,111.27 128.45,114.34 101.91,114.34 100.79,113.23 GPIO1.10
PD7
  Top 0.305: MOTOR_DRIVER.4 137.53,99.26 137.53,99.95 136.28,101.21 136.28,106.52 125.38,117.42 102.47,117.42 100.79,115.74 GPIO1.9
  Bottom 0.305: EYFI_MEGA.9 100.81,101.75 100.81,111.25 99.54,112.53 99.54,114.48 100.65,115.6 GPIO1.9
PE2
  Top 0.305: EYFI_MEGA.20 88.08,99.95 86.82,101.21 86.82,111.18 88.02,112.37 GPIO1.20
PG0
  Top 0.305: EYFI_MEGA.8 103.29,99.18 102.05,100.42 102.05,111.97 103.17,113.09 GPIO1.8
PG1
  Top 0.305: EYFI_MEGA.7 103.32,101.74 104.43,102.84 104.43,114.48 103.31,115.6 GPIO1.7
PG2  (via drill 0.35)
  Top 0.305: GPIO3.11 98.14,36.95 97.02,38.07 97.02,49.7 98.24,50.92 EYFI_MEGA.94 | v45.86,125.97 45.86,125.89 65.03,106.72 65.03,72.99 v84.17,53.85
  Bottom 0.305: v45.86,125.97 44.35,127.48 44.35,133.02 55.71,144.37 58.41,144.37 59.12,143.66 ULTRASONIC.2 | v84.17,53.85 95.34,53.85 98.24,50.96 EYFI_MEGA.94
PH2
  Bottom 0.305: EYFI_MEGA.19 88.08,111.17 89.2,112.29 89.2,114.48 88.08,115.6 GPIO1.19
PH7
  Top 0.305: GPIO1.18 90.56,112.39 89.34,111.18 89.34,101.35 90.6,100.09 90.6,99.26 EYFI_MEGA.18
PJ2
  Bottom 0.305: EYFI_MEGA.89 93.11,48.27 93.11,38.86 91.85,37.61 91.85,35.55 92.97,34.44 GPIO3.16
PJ3
  Top 0.305: EYFI_MEGA.90 93.11,50.92 93.11,50.4 91.91,49.2 91.91,47.93 93.05,46.79 93.05,36.92 GPIO3.15
PJ4
  Top 0.305: EYFI_MEGA.91 95.76,48.27 95.76,38.49 96.88,37.37 96.88,35.55 95.76,34.44 GPIO3.14
PJ5
  Top 0.305: GPIO3.13 95.62,36.95 94.51,38.07 94.51,49.76 95.68,50.93 EYFI_MEGA.92
PJ6  (via drill 0.35)
  Top 0.305: v46.73,123.76 64.47,106.02 64.47,68.52 84.31,48.69 84.31,39.74 86.82,37.23 86.82,36.39 87.66,35.55 88.5,35.55 89.34,34.72 89.34,33.88 90.04,33.18 97.02,33.18 98.14,34.3 GPIO3.12
  Bottom 0.305: EYFI_MEGA.93 98.28,48.27 98.28,38.49 99.4,37.37 99.4,35.55 98.28,34.44 GPIO3.12 | v46.73,123.76 46.73,129.15 57.51,139.93 59.26,139.93 61.64,142.3 ULTRASONIC.3
PL0
  Top 0.305: GPIO1.17 91.85,114.34 91.85,112.27 90.73,111.15 90.73,101.77 EYFI_MEGA.17
PL1
  Top 0.305: EYFI_MEGA.16 93.15,99.18 91.99,100.34 91.99,110.94 93.1,112.04 GPIO1.16
PL2
  Top 0.305: EYFI_MEGA.15 93.25,101.77 93.25,110.84 94.37,111.95 94.37,114.34 93.11,115.6 GPIO1.15
PL6
  Top 0.305: EYFI_MEGA.14 94.51,100.38 94.51,110.86 95.64,111.99 GPIO1.14
PL7
  Top 0.305: EYFI_MEGA.13 95.76,101.77 95.76,110.76 96.88,111.87 96.88,114.48 95.76,115.6 GPIO1.13
RST
  Top 0.305: EYFI_MEGA.37 46.73,85.81 46.73,104.95 39.44,112.24 PWM1_2.10
RX1  (via drill 0.35)
  Top 0.305: ARDU_CAM.5 71.18,12.13 v71.18,16.23
  Bottom 0.305: UART1.7 72.85,115.6 73.97,114.48 73.97,112.53 72.85,111.41 72.85,101.63 EYFI_MEGA.29 72.85,101.49 73.97,100.38 73.97,98.7 79.98,92.69 79.98,65.59 80.26,65.31 80.26,59.44 79.14,58.32 79.14,33.46 71.1,25.42 71.1,16.31 v71.18,16.23
RX2
  Top 0.305: EYFI_MEGA.27 75.23,101.63 75.23,111.41 74.11,112.53 74.11,114.48 75.23,115.6 UART1.5
RX3
  Bottom 0.305: EYFI_MEGA.25 77.74,101.63 77.74,111.55 76.63,112.67 76.63,114.48 77.74,115.6 UART1.3
SCK
  Top 0.305: EYFI_MEGA.76 72.71,50.78 72.71,49.94 71.6,48.82 71.6,38.07 72.71,36.95 SPI1.7
SCL
  Top 0.305: I2C_HEADER_1.3 113.65,27.59 110.29,24.24 104.57,24.24 OLED_1.3 102.61,22.28 102.61,16.97 OLED_2.3 102.61,16.83 102.61,11.52 LINE_FOLLOWER_HEADER.3
  Bottom 0.305: I2C_HEADER_2.3 100.09,27.59 100.09,24.94 102.61,22.42 OLED_1.3 | ARDU_CAM.3 67.4,10.83 68.24,10.83 70.22,8.85 100.95,8.85 102.5,10.4 LINE_FOLLOWER_HEADER.3 | 82.07,73.69 96.6,73.69 116.72,53.57 EYFI_MEGA.108 116.86,53.43 116.86,51.48 125.1,43.24 125.1,41.7 I2C1.5 125.1,41.56 123.98,40.44 123.98,38.77 113.79,28.57 113.79,27.73 I2C_HEADER_1.3
SDA
  Top 0.305: OLED_2.4 105.12,16.97 105.12,22.28 OLED_1.4 105.26,22.42 110.99,22.42 116.16,27.59 I2C_HEADER_1.2 116.3,27.73 116.3,28.57 126.5,38.77 126.5,40.44 127.62,41.56 I2C1.3 127.62,41.7 127.62,44.35 118.67,53.3 118.67,55.25 EYFI_MEGA.110 | ARDU_CAM.4 67.29,13.4 66.15,12.26 66.15,10.17 67.47,8.85 77.3,8.85 78.86,10.41 78.86,11.39 79.7,12.22 87.38,12.22 88.64,13.48 98,13.48 99.95,11.52 LINE_FOLLOWER_HEADER.2
  Bottom 0.305: I2C_HEADER_2.2 102.75,27.59 102.75,24.8 105.12,22.42 OLED_1.4 | OLED_2.4 105.12,16.83 105.12,16.55 100.09,11.52 LINE_FOLLOWER_HEADER.2 | 82.07,76.21 97.72,76.21 118.54,55.39 EYFI_MEGA.110
SS0/PB0
  Top 0.305: EYFI_MEGA.73 70.34,48.27 70.34,38.49 71.46,37.37 71.46,35.55 70.34,34.44 SPI1.10
SS1/PJ7
  Bottom 0.305: EYFI_MEGA.74 70.34,50.78 70.34,49.94 71.46,48.82 71.46,38.07 70.34,36.95 SPI1.9
TX1
  Bottom 0.305: EYFI_MEGA.30 72.71,99.12 72.71,99.95 71.6,101.07 71.6,111.97 72.71,113.09 UART1.8
TX2
  Bottom 0.305: EYFI_MEGA.28 75.37,99.12 75.37,99.95 76.49,101.07 76.49,111.97 75.37,113.09 UART1.6
TX3
  Top 0.305: EYFI_MEGA.26 77.74,99.12 77.74,99.95 76.63,101.07 76.63,111.97 77.74,113.09 UART1.4
XCLK
  Top 0.305: R11.1 74.95,20.33 72.57,20.33 R10.1 72.43,20.19 72.43,13.48 ARDU_CAM.8